# Altium project Power_Board.PrjPcb (part 2 of 3)

## Sheet Power_Reset.SchDoc: =SheetTitle
size A4; SheetTitle: Logic Power & Reset; DrawnBy: Samyar Sadat Akhavi; DocumentNumber: 4; SheetNumber: 4; SheetTotal: 19
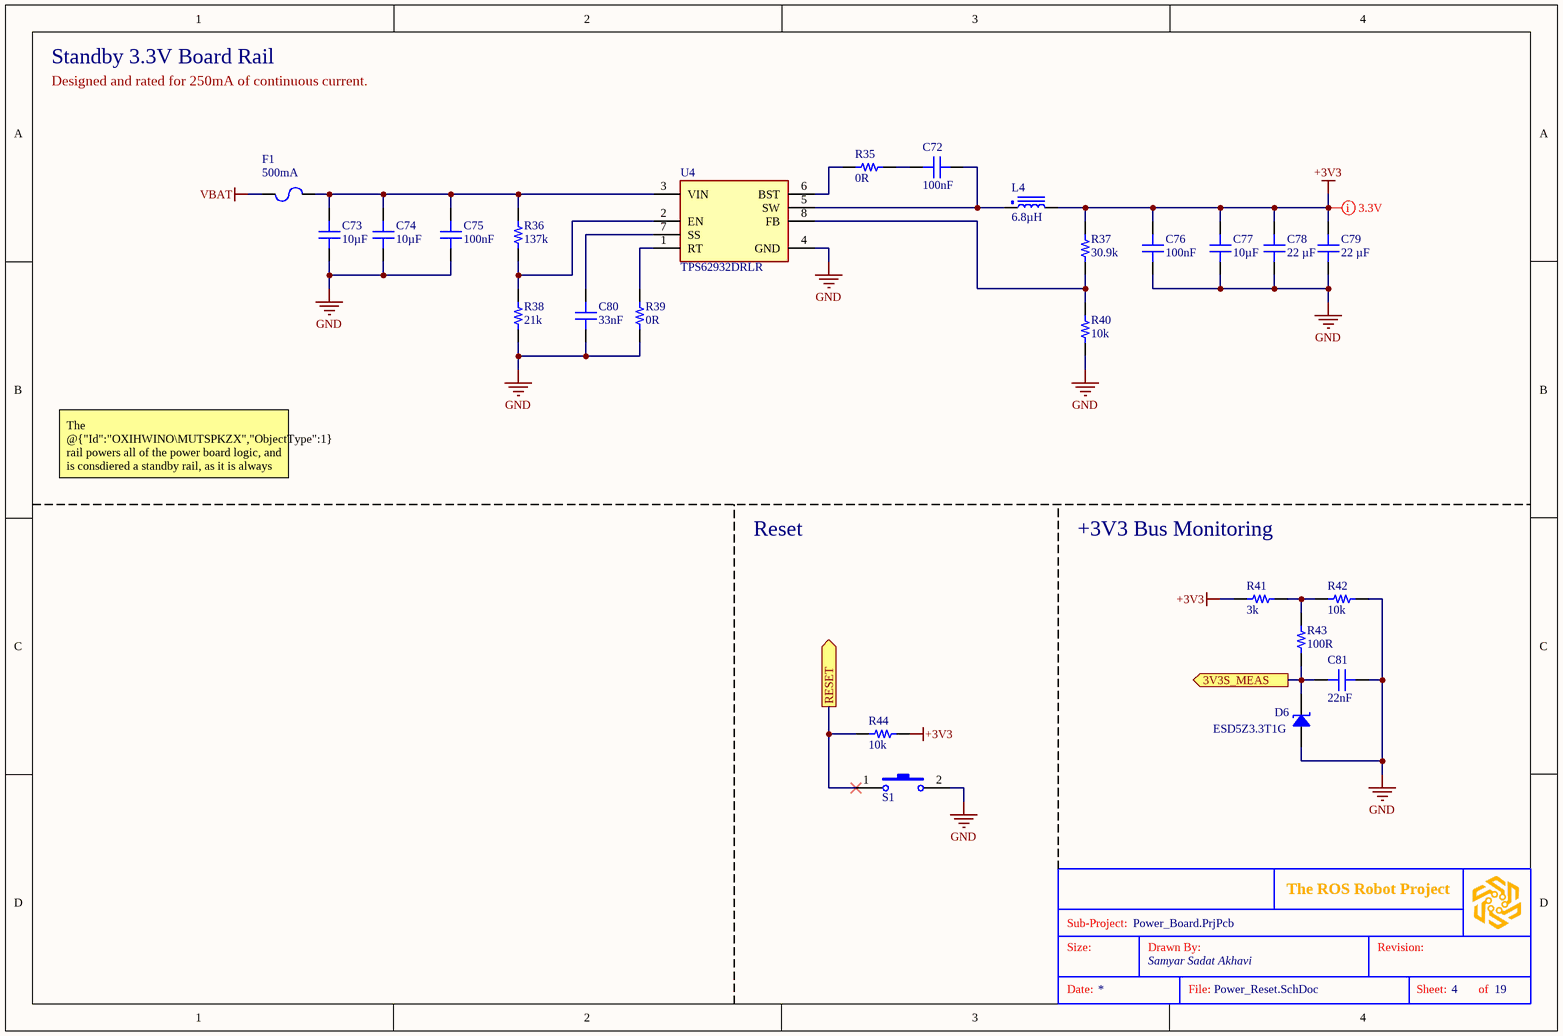
[diagram p7: Power_Reset.SchDoc]

### Parts
(Parts that share a designator on the sheet are numbered #1, #2 ... from top to bottom, then left to right.)
?#6  (no value)  (graphical)
C72  100nF  [CAP 0603_1608]
C73  10µF  [CAP 1206_3216]
C74  10µF  [CAP 1206_3216]
C75  100nF  [CAP 0603_1608]
C76  100nF  [CAP 0603_1608]
C77  10µF  [CAP 1206_3216]
C78  22 µF  [CAP 1206_3216 - 0.8MM]
C79  22 µF  [CAP 1206_3216 - 0.8MM]
C80  33nF  [CAP 0603_1608]
C81  22nF  [CAP 0603_1608]
D6  ESD5Z3.3T1G  [SOD523F]
F1  Current Rating (Amps): 500mA  [FUSE 1206_3216 0.6MM]  (hidden comment: SF-1206F050-2)
L4  6.8µH  [INDPM8682X400N]
R35  0R  [RES 0603_1608]
R36  137k  [RES 0603_1608]
R37  30.9k  [RES 0603_1608]
R38  21k  [RES 0603_1608]
R39  0R  [RES 0603_1608]
R40  10k  [RES 0603_1608]
R41  3k  [RES 0603_1608]
R42  10k  [RES 0603_1608]
R43  100R  [RES 0603_1608]
R44  10k  [RES 0603_1608]
S1  PTS815SJK250SMTRLFS  [PTS815SJK250SMTRLFS]  (value not drawn)
U4  TPS62932DRLR  [SOT8_DRL_TEX]

### Ports
3V3S_MEAS (out, see Power_Board[2A], Microcontroller[3C]), RESET (out, see Power_Board[2A])

### Nets
+3V3: C76.1 C77.2 C78.2 C79.2 L4.2 R37.2 R41.1 R44.1
GND: C73.1 C74.1 C75.2 C76.2 C77.1 C78.1 C79.1 C80.1 C81.2 D6.1 R38.1 R39.1 R40.1 R42.2 S1.2(NO) U4.4(GND)
VBAT: F1.1
3V3S_MEAS: C81.1 D6.2 R43.2 ; port 3V3S_MEAS
RESET: R44.2 S1.1(COM) ; port RESET
NetC72_1: C72.1 R35.1
NetC72_2: C72.2 L4.1 U4.5(SW)
NetC73_2: C73.2 C74.2 C75.1 F1.2 R36.2 U4.3(VIN)
NetC80_2: C80.2 U4.7(SS)
NetR35_2: R35.2 U4.6(BST)
NetR36_1: R36.1 R38.2 U4.2(EN)
NetR37_1: R37.1 R40.2 U4.8(FB)
NetR39_2: R39.2 U4.1(RT)
NetR41_2: R41.2 R42.1 R43.1

### Layout directives
rule Supply Nets [Voltage = 3.300]: +3V3

### Notes on the sheet
- Standby 3.3V Board Rail
- Designed and rated for 250mA of continuous current.
- The @{"Id":"OXIHWINO\MUTSPKZX","ObjectType":1} rail powers all of the power board logic, and is consdiered a standby rail, as it is always on (assuming battery voltage is >9V).
- Reset
- +3V3 Bus Monitoring
- Sub-Project:
- Size:
- Drawn By:
- Revision:
- Date:
- File:
- Sheet:
- of

### Library data of the parts
?#6 = SGR-STDTBSA4: STANDARD SCHEMATICS TITLE BLOCK
C72 C75 C76 = GEN-CC100NT10V50KX7R603: as C23 on sheet Voltage_Reg_12V; Part Number: GEN-CC100NT10V50KX7R603; Value: 100nF
C73 C74 C77 = GEN-CC10UT10V25KX7R1206: GENERIC 1206 MLC CAPACITOR; Tolerance: ±10%; Voltage: 25V; Dielectric: X7R; Part Number: GEN-CC10UT10V25KX7R1206; Value: 10µF
C78 C79 = CL31A226KAHNNNE: as C15 on sheet Voltage_Reg_SBC; Part Number: CL31A226KAHNNNE; Capacitance: 22 µF; Applications: General Purpose; componentlink1description: Datasheet; componentlink1url: http://www.samsungsem.com/kr/support/product-search/mlcc/CL31A226KAHNNNE.jsp; componentlink2description: DigiKey Link; componentlink2url: https://www.digikey.com/en/products/detail/samsung-electro-mechanics/CL31A226KAHNNNE/3888705; Device Package: 1206 (3216 Metric); lastupdated: 4/6/2026 7:37:25 PM; Lifecycle Status: Active; Minimum Order: 1; Mounting Type: Surface Mount, MLCC; Operating Temperature: -55°C ~ 85°C; Package / Case: 1206 (3216 Metric); packaging: TapeAndReel; partid: 22185; Part Status: Active; price: 0.06; series: CL; Size / Dimension: 0.126" L x 0.063" W (3.20mm x 1.60mm); Supplier 1: DigiKey; Supplier Part Number 1: 1276-3047-1-ND; Temperature Coefficient: X5R; Thickness (Max): 0.071" (1.80mm); value: 22 µF; Voltage - Rated: 25V
C80 = GEN-CC33NT5V25KX7R603: GENERIC 0603 MLC CAPACITOR; Tolerance: ±5%; Voltage: 25V; Dielectric: X7R; Part Number: GEN-CC33NT5V25KX7R603; Value: 33nF
C81 = GEN-CC22NT20V25KX7R603: GENERIC 0603 MLC CAPACITOR; Tolerance: ±20%; Voltage: 25V; Dielectric: X7R; Part Number: GEN-CC22NT20V25KX7R603; Value: 22nF
D6 = ESD5Z3.3T1G: TVS DIODE 3.3V 14.1V SOD523; Manufacturer: ON Semiconductor; Capacitance @ Frequency: 105pF @ 1MHz; Current - Peak Pulse (10/1000µs): 11.2A (8/20µs); Power Line Protection: No; Power - Peak Pulse: 158W; Type: Zener; Unidirectional Channels: 1; Voltage - Breakdown (Min): 5V; Voltage - Reverse Standoff (Typ): 3.3V (Max); Part Number: ESD5Z3.3T1G; Applications: General Purpose; ComponentLink1Description: Datasheet; ComponentLink1URL: https://www.onsemi.com/pub/Collateral/ESD5Z2.5T1-D.PDF; ComponentLink2Description: DigiKey Link; ComponentLink2URL: http://digikey.com/product-detail/en/on-semiconductor/ESD5Z3.3T1G/ESD5Z3.3T1GOSCT-ND/1967044; LastUpdated: 4/5/2026 9:01:13 PM; Lifecycle Status: Active; Minimum Order: 1; Mounting Type: Surface Mount; Operating Temperature: -55°C ~ 150°C (TJ); Package / Case: SC-79, SOD-523; Packaging: TapeAndReel; PartId: 9754; Part Status: Active; Price: 0.04; Series: -; Supplier 1: DigiKey; Supplier Part Number 1: ESD5Z3.3T1GOSCT-ND; Supplier Device Package: SOD-523; Voltage - Clamping (Max) @ Ipp: 14.1V
F1 = SF-1206F050-2: FUSE BOARD MNT 500MA 63VDC 1206; Manufacturer: Bourns Inc.; Approval Agency: UL; Breaking Capacity @ Rated Voltage: 50A; Fuse Type: Board Mount (Cartridge Style Excluded); Melting I²t: 0.011; Response Time: Fast Blow; Voltage Rating - DC: 63V; Part Number: SF-1206F050-2; Approvals: UL; ComponentLink1Description: Datasheet; ComponentLink1URL: https://www.bourns.com/pdfs/SF1206F.pdf; ComponentLink2Description: DigiKey Link; ComponentLink2URL: http://digikey.com/product-detail/en/bourns-inc/SF-1206F050-2/SF-1206F050-2CT-ND/1948200; Device Package: 1206 (3216 Metric); LastUpdated: 9/2/2020 1:30:42 AM; Lifecycle Status: Active; Minimum Order: 1; Mounting Type: Surface Mount; Operating Temperature: -40°C ~ 105°C; Package / Case: 1206 (3216 Metric); Packaging: TapeAndReel; Part Status: Active; Price: 0.31; Series: SinglFuse™ SF-1206F; Size / Dimension: 0.122" L x 0.061" W x 0.024" H (3.10mm x 1.55mm x 0.60mm); Supplier 1: DigiKey; Supplier Part Number 1: SF-1206F050-2CT-ND
L4 = IHLP3232DZER6R8M11: FIXED IND 6.8UH 7A 33.4 MOHM SMD; Manufacturer: Vishay Dale; Tolerance: ±20%; Saturation Current: 6.7A; Part Number: IHLP3232DZER6R8M11; Value: 6.8µH; Current Rating: 7A; DC Resistance: 33.4mOhm; Supplier 1: DigiKey; Supplier Part Number 1: 541-1355-1-ND
R35 R39 = GEN-CRR0603: GENERIC 0603 CHIP RESISTOR (JUMPER); Part Number: GEN-CRR0603; Value: 0R
R36 = GEN-CRR137KT1P8603: GENERIC 0603 CHIP RESISTOR; Tolerance: ±1%; Power: 0.125W; Part Number: GEN-CRR137KT1P8603; Value: 137k
R37 = GEN-CRR30K9T1P8603: GENERIC 0603 CHIP RESISTOR; Tolerance: ±1%; Power: 0.125W; Part Number: GEN-CRR30K9T1P8603; Value: 30.9k
R38 = GEN-CRR21KT1P8603: GENERIC 0603 CHIP RESISTOR; Tolerance: ±1%; Power: 0.125W; Part Number: GEN-CRR21KT1P8603; Value: 21k
R40 R42 R44 = GEN-CRR10KT1P8603: as R18 on sheet Voltage_Reg_12V; Part Number: GEN-CRR10KT1P8603; Value: 10k
R41 = GEN-CRR3KT1P8603: GENERIC 0603 CHIP RESISTOR; Tolerance: ±1%; Power: 0.125W; Part Number: GEN-CRR3KT1P8603; Value: 3k
R43 = GEN-CRR100T1P8603: as R77 on sheet STD_Protect; Part Number: GEN-CRR100T1P8603; Value: 100R
S1 = PTS815SJK250SMTRLFS: SWITCH TACTILE SPST-NO 0.05A 12V; Manufacturer: C&K; Part Number: PTS815SJK250SMTRLFS; Circuit: SPST-NO; Supplier 1: DigiKey; Supplier Part Number 1: CKN12216-1-ND
U4 = TPS62932DRLR: IC REG BUCK ADJ 2A SOT583; Manufacturer: Texas Instruments; Copyright: Copyright (C) 2025 Ultra Librarian. All rights reserved.; Part Number: TPS62932DRLR; Supplier 1: DigiKey; Supplier Part Number 1: 296-TPS62932DRLRCT-ND

## Sheet Microcontroller.SchDoc: =SheetTitle
size B; SheetTitle: Microcontroller; DrawnBy: Samyar Sadat Akhavi; DocumentNumber: 5; SheetNumber: 5; SheetTotal: 19
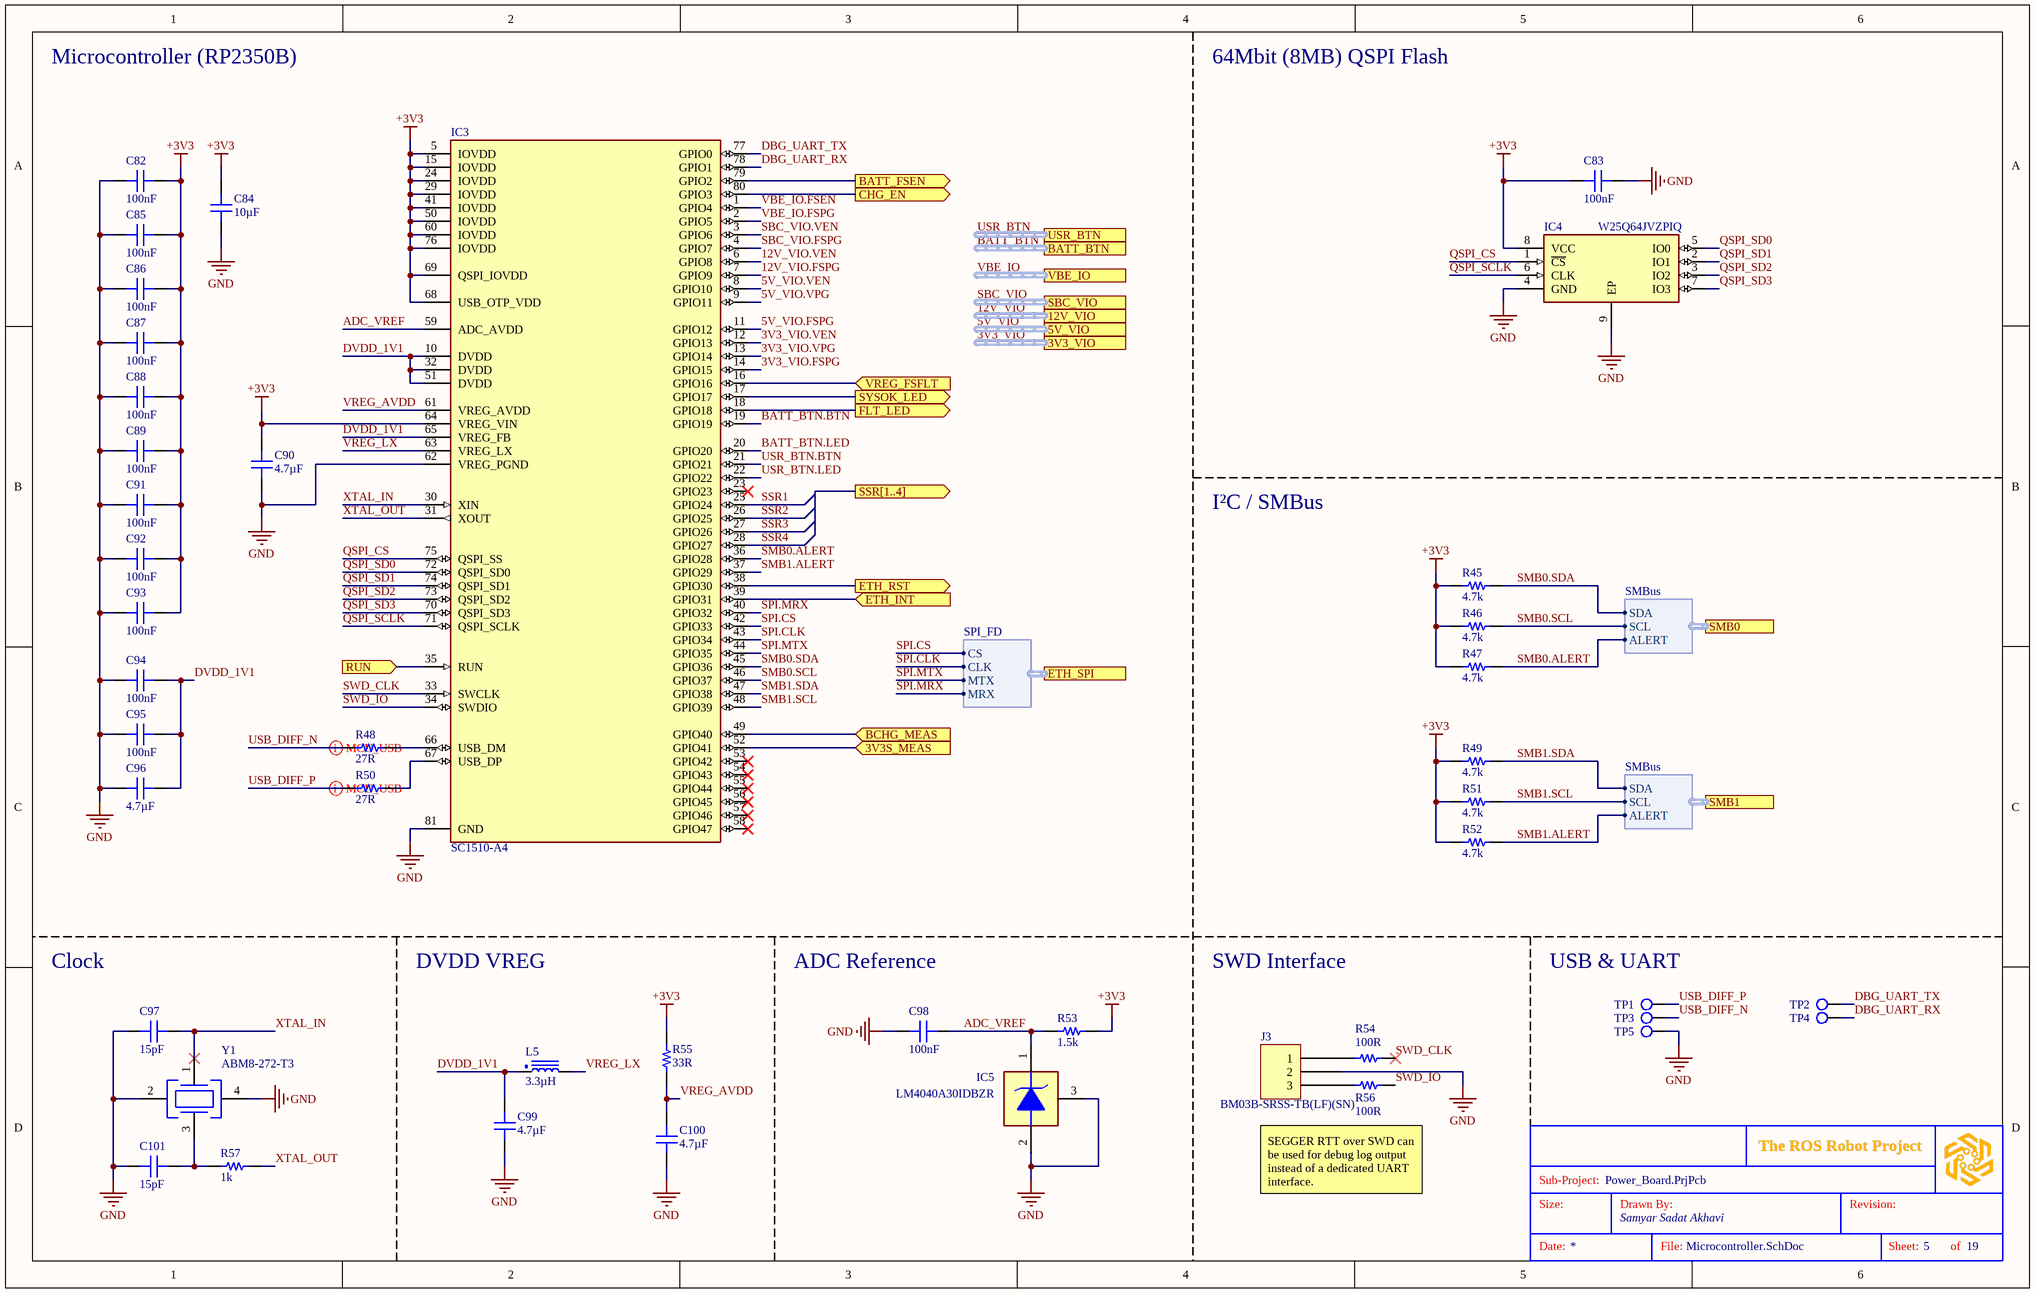
[diagram p8: Microcontroller.SchDoc]

### Parts
(Parts that share a designator on the sheet are numbered #1, #2 ... from top to bottom, then left to right.)
?#7  (no value)  (graphical)
C82  100nF  [CAP 0402_1005]
C83  100nF  [CAP 0603_1608]
C84  10µF  [CAP 1206_3216]
C85  100nF  [CAP 0402_1005]
C86  100nF  [CAP 0402_1005]
C87  100nF  [CAP 0402_1005]
C88  100nF  [CAP 0402_1005]
C89  100nF  [CAP 0402_1005]
C90  4.7µF  [CAP 0402_1005]
C91  100nF  [CAP 0402_1005]
C92  100nF  [CAP 0402_1005]
C93  100nF  [CAP 0402_1005]
C94  100nF  [CAP 0402_1005]
C95  100nF  [CAP 0402_1005]
C96  4.7µF  [CAP 0402_1005]
C97  15pF  [CAP 0402_1005]
C98  100nF  [CAP 0603_1608]
C99  4.7µF  [CAP 0402_1005]
C100  4.7µF  [CAP 0402_1005]
C101  15pF  [CAP 0402_1005]
IC3  SC1510-A4  [QFN40P1000X1000X90-81N-D]
IC4  W25Q64JVZPIQ  [SON127P600X500X80-9N-D]
IC5  LM4040A30IDBZR  [SOT95P237X112-3N]
J3  BM03B-SRSS-TB(LF)(SN)  [JST BM03B-SRSS-TB]
L5  3.3µH  [AOTAB201610S3R3101T]
R45  4.7k  [RES 0603_1608]
R46  4.7k  [RES 0603_1608]
R47  4.7k  [RES 0603_1608]
R48  27R  [RES 0603_1608]
R49  4.7k  [RES 0603_1608]
R50  27R  [RES 0603_1608]
R51  4.7k  [RES 0603_1608]
R52  4.7k  [RES 0603_1608]
R53  1.5k  [RES 0603_1608]
R54  100R  [RES 0603_1608]
R55  33R  [RES 0402_1005]
R56  100R  [RES 0603_1608]
R57  1k  [RES 0402_1005]
TP1  Test Point  [Test_Point_2mm]  (value not drawn)  (no BOM)
TP2  Test Point  [Test_Point_2mm]  (value not drawn)  (no BOM)
TP3  Test Point  [Test_Point_2mm]  (value not drawn)  (no BOM)
TP4  Test Point  [Test_Point_2mm]  (value not drawn)  (no BOM)
TP5  Test Point  [Test_Point_2mm]  (value not drawn)  (no BOM)
Y1  ABM8-272-T3  [ABM8272T3]

### Ports
3V3_VIO (harness V3I_VIO, see Power_Board[3B], Voltage_Regulators[5D]), 3V3S_MEAS (in, see Power_Board[2A], Power_Reset[4C]), 5V_VIO (harness V3I_VIO, see Power_Board[3B], Voltage_Regulators[5C]), 12V_VIO (harness VHP_VIO, see Power_Board[3B], Voltage_Regulators[5B]), BATT_BTN (harness USR_BTN, see Power_Board[2B], User_Control_IO[4A]), BATT_FSEN (out, see Power_Board[2B]), BCHG_MEAS (in, see Power_Board[2B], Charger_Input[2B]), CHG_EN (out, see Power_Board[2B], Charger_Input[1B]), ETH_INT (in, see Power_Board[3B]), ETH_RST (out, see Power_Board[3B]), ETH_SPI (harness SPI_FD, see Power_Board[3B]), FLT_LED (out, see Power_Board[3C]), RUN (in, see Power_Board[2A]), SBC_VIO (harness VHP_VIO, see Power_Board[3B], Voltage_Regulators[5A]), SMB0 (harness SMBus, see Power_Board[2C]), SMB1 (harness SMBus, see Power_Board[2C]), SSR[1..4] (out, see Power_Board[3B], External_SSR[2A]), SYSOK_LED (out, see Power_Board[3C]), USR_BTN (harness USR_BTN, see Power_Board[2B], User_Control_IO[4C]), VBE_IO (harness VBP_IO, see Power_Board[3A], VBAT_Output[1B]), VREG_FSFLT (in, see Power_Board[3B])

### Harnesses
SMBus: SDA, SCL, ALERT
SPI_FD: MRX, MTX, CLK, CS

### Nets
+3V3: C82.2 C83.1 C84.2 C85.2 C86.2 C87.2 C88.2 C89.2 C90.2 C91.2 C92.2 C93.2 IC3.5(IOVDD) IC3.15(IOVDD) IC3.24(IOVDD) IC3.29(IOVDD) IC3.41(IOVDD) IC3.50(IOVDD) IC3.60(IOVDD) IC3.64(VREG_VIN) IC3.68(USB_OTP_VDD) IC3.69(QSPI_IOVDD) IC3.76(IOVDD) IC4.8(VCC) R45.1 R46.1 R47.1 R49.1 R51.1 R52.1 R53.2 R55.2
GND: C82.1 C83.2 C84.1 C85.1 C86.1 C87.1 C88.1 C89.1 C90.1 C91.1 C92.1 C93.1 C94.1 C95.1 C96.1 C97.1 C98.1 C99.1 C100.1 C101.1 IC3.62(VREG_PGND) IC3.81(GND) IC4.4(GND) IC4.9(EP) IC5.2(A) IC5.3 J3.2 TP5.1 Y1.2(GND_1) Y1.4(GND_2)
3V3_VIO.FSPG: IC3.14(GPIO15)
3V3_VIO.VEN: IC3.12(GPIO13)
3V3_VIO.VPG: IC3.13(GPIO14)
3V3S_MEAS: IC3.52(GPIO41) ; port 3V3S_MEAS
5V_VIO.FSPG: IC3.11(GPIO12)
5V_VIO.VEN: IC3.8(GPIO10)
5V_VIO.VPG: IC3.9(GPIO11)
12V_VIO.FSPG: IC3.7(GPIO9)
12V_VIO.VEN: IC3.6(GPIO8)
ADC_VREF: C98.2 IC3.59(ADC_AVDD) IC5.1(K) R53.1
BATT_BTN.BTN: IC3.19(GPIO19)
BATT_BTN.LED: IC3.20(GPIO20)
BCHG_MEAS: IC3.49(GPIO40) ; port BCHG_MEAS
BEFS_EN: IC3.79(GPIO2) ; port BATT_FSEN
CHG_EN: IC3.80(GPIO3) ; port CHG_EN
DBG_UART_RX: IC3.78(GPIO1) TP4.1
DBG_UART_TX: IC3.77(GPIO0) TP2.1
DVDD_1V1: C94.2 C95.2 C96.2 C99.2 IC3.10(DVDD) IC3.32(DVDD) IC3.51(DVDD) IC3.65(VREG_FB) L5.1
ETH_INT: IC3.39(GPIO31) ; port ETH_INT
ETH_RST: IC3.38(GPIO30) ; port ETH_RST
FLT_LED: IC3.18(GPIO18) ; port FLT_LED
FS_GFLT: IC3.16(GPIO16) ; port VREG_FSFLT
QSPI_CS: IC3.75(QSPI_SS) IC4.1(~{CS})
QSPI_SCLK: IC3.71(QSPI_SCLK) IC4.6(CLK)
QSPI_SD0: IC3.72(QSPI_SD0) IC4.5(IO0)
QSPI_SD1: IC3.74(QSPI_SD1) IC4.2(IO1)
QSPI_SD2: IC3.73(QSPI_SD2) IC4.3(IO2)
QSPI_SD3: IC3.70(QSPI_SD3) IC4.7(IO3)
RESET: IC3.35(RUN) ; port RUN
SBC_VIO.FSPG: IC3.4(GPIO7)
SBC_VIO.VEN: IC3.3(GPIO6)
SMB0.ALERT: IC3.36(GPIO28) R47.2 ; port SMB0.ALERT  [project net SMB.ALERT]
SMB0.SCL: IC3.46(GPIO37) R46.2 ; port SMB0.SCL  [project net SMB.SCL]
SMB0.SDA: IC3.45(GPIO36) R45.2 ; port SMB0.SDA  [project net SMB.SDA]
SMB1.ALERT: IC3.37(GPIO29) R52.2 ; port SMB1.ALERT  [project net SMB.ALERT]
SMB1.SCL: IC3.48(GPIO39) R51.2 ; port SMB1.SCL  [project net SMB.SCL]
SMB1.SDA: IC3.47(GPIO38) R49.2 ; port SMB1.SDA  [project net SMB.SDA]
SPI.CLK: IC3.43(GPIO34) ; port ETH_SPI.CLK
SPI.CS: IC3.42(GPIO33) ; port ETH_SPI.CS
SPI.MRX: IC3.40(GPIO32) ; port ETH_SPI.MRX
SPI.MTX: IC3.44(GPIO35) ; port ETH_SPI.MTX
SSR1: IC3.25(GPIO24)
SSR2: IC3.26(GPIO25)
SSR3: IC3.27(GPIO26)
SSR4: IC3.28(GPIO27)
SWD_CLK: IC3.33(SWCLK) R54.1
SWD_IO: IC3.34(SWDIO) R56.1
SYSOK_LED: IC3.17(GPIO17) ; port SYSOK_LED
USB_DIFF_N: R48.1 TP3.1
USB_DIFF_P: R50.1 TP1.1
USR_BTN.BTN: IC3.21(GPIO21)
USR_BTN.LED: IC3.22(GPIO22)
VBE_IO.FSEN: IC3.1(GPIO4)
VBE_IO.FSPG: IC3.2(GPIO5)
VREG_AVDD: C100.2 IC3.61(VREG_AVDD) R55.1
VREG_LX: IC3.63(VREG_LX) L5.2
XTAL_IN: C97.2 IC3.30(XIN) Y1.1(CRYSTAL_1)
XTAL_OUT: IC3.31(XOUT) R57.2
NetC101_2: C101.2 R57.1 Y1.3(CRYSTAL_2)
NetIC3_66: IC3.66(USB_DM) R48.2
NetIC3_67: IC3.67(USB_DP) R50.2
NetJ3_1: J3.1 R54.2
NetJ3_3: J3.3 R56.2

Not connected (* = marked no-connect by the designer): IC3 23(GPIO23)* 53(GPIO42)* 54(GPIO43)* 55(GPIO44)* 56(GPIO45)* 57(GPIO46)* 58(GPIO47)*

### Buses and harness runs
harness 3V3_VIO = port 3V3_VIO
harness 5V_VIO = port 5V_VIO
harness 12V_VIO = port 12V_VIO
harness BATT_BTN = port BATT_BTN
harness SBC_VIO = port SBC_VIO
harness USR_BTN = port USR_BTN
harness VBE_IO = port VBE_IO

### Layout directives
differential pair: USB_DIFF_N, USB_DIFF_P

### Notes on the sheet
- Microcontroller (RP2350B)
- 64Mbit (8MB) QSPI Flash
- I²C / SMBus
- Clock
- DVDD VREG
- ADC Reference
- SWD Interface
- USB & UART
- SEGGER RTT over SWD can be used for debug log output instead of a dedicated UART interface.
- Sub-Project:
- Size:
- Drawn By:
- Revision:
- Date:
- File:
- Sheet:
- of

### Library data of the parts
?#7 = SGR-STDTBSB: STANDARD SCHEMATICS TITLE BLOCK
C82 C85-C89 C91-C95 = GEN-CC100NT106V3KX7R402: GENERIC 0402 MLC CAPACITOR; Tolerance: ±10%; Voltage: 6.3V; Dielectric: X7R; Part Number: GEN-CC100NT106V3KX7R402; Value: 100nF
C83 C98 = GEN-CC100NT10V50KX7R603: as C23 on sheet Voltage_Reg_12V; Part Number: GEN-CC100NT10V50KX7R603; Value: 100nF
C84 = GEN-CC10UT10V25KX7R1206: as C73 on sheet Power_Reset; Part Number: GEN-CC10UT10V25KX7R1206; Value: 10µF
C90 C96 C99 C100 = GEN-CC4U7T106V3KX5R402: GENERIC 0402 MLC CAPACITOR; Tolerance: ±10%; Voltage: 6.3V; Dielectric: X5R; Part Number: GEN-CC4U7T106V3KX5R402; Value: 4.7µF
C97 C101 = GEN-CC15PT1V25KC0G402: GENERIC 0402 MLC CAPACITOR; Tolerance: ±1%; Voltage: 25V; Dielectric: C0G; Part Number: GEN-CC15PT1V25KC0G402; Value: 15pF
IC3 = SC1510-A4: RASPBERRY PI RP2350B A4 MICROCONTROLLER; Part Number: SC1510-A4; Manufacturer: Raspberry Pi; Supplier 1: DigiKey; Supplier Part Number 1: 2648-SC1510-A4CT-ND
IC4 = W25Q64JVZPIQ: IC FLASH 64MBIT SPI/QUAD 8WSON; Manufacturer: Winbond Electronics; Part Number: W25Q64JVZPIQ; Supplier 1: DigiKey; Supplier Part Number 1: 256-W25Q64JVZPIQ-TRAY-ND
IC5 = LM4040A30IDBZR: IC VREF SHUNT 0.1% SOT23-3; Manufacturer: Texas Instruments; Part Number: LM4040A30IDBZR; Supplier 1: DigiKey; Supplier Part Number 1: 296-20861-1-ND
J3 = BM03B-SRSS-TB(LF)(SN): CONN HEADER SMD 3POS 1MM; Manufacturer: JST Sales America Inc.; Current Rating (Amps): 0.7A; Material Flammability Rating: UL94 V-0; Number of Positions: 3; Number of Positions Loaded: All; Pitch - Mating: 0.039" (1.00mm); Shrouding: Shrouded - 4 Wall; Style: Board to Cable/Wire; Voltage Rating: 50V; Part Number: BM03B-SRSS-TB(LF)(SN); ComponentLink1Description: Datasheet; ComponentLink1URL: http://www.jst-mfg.com/product/pdf/eng/eSR.pdf; ComponentLink2Description: DigiKey Link; ComponentLink2URL: http://digikey.com/product-detail/en/jst-sales-america-inc/BM03B-SRSS-TB-LF-SN/455-1789-1-ND/926860; Connector Type: Header; Contact Finish - Mating: Tin; Contact Finish - Post: Tin; Contact Material: Copper Alloy; Contact Shape: Square; Contact Type: Male Pin; Fastening Type: Push-Pull; Features: Solder Retention; Insulation Color: Natural; Insulation Height: 0.167" (4.25mm); Insulation Material: Polyamide (PA), Nylon; LastUpdated: 1/12/2020 10:12:14 PM; Lifecycle Status: Active; Minimum Order: 1; Mounting Type: Surface Mount; Number of Rows: 1; Operating Temperature: -25°C ~ 85°C; Packaging: TapeAndReel; PartId: 14; Part Status: Active; Price: 0.24; Series: SR; Supplier 1: DigiKey; Supplier Part Number 1: 455-1789-1-ND; Termination: Solder
L5 = AOTA-B201610S3R3-101-T: FIXED IND 3.3UH 2.1A 140 MOHM; Manufacturer: Abracon LLC; Tolerance: ±20%; Saturation Current: 2.4A; Part Number: AOTA-B201610S3R3-101-T; Value: 3.3µH; Current Rating: 2.1A; DC Resistance: 140mOhm; Supplier 1: DigiKey; Supplier Part Number 1: 535-AOTA-B201610S3R3-101-TCT-ND
R45-R47 R49 R51 R52 = GEN-CRR4K7T5P8603: GENERIC 0603 CHIP RESISTOR; Tolerance: ±5%; Power: 0.125W; Part Number: GEN-CRR4K7T5P8603; Value: 4.7k
R48 R50 = GEN-CRR27T1P8603: GENERIC 0603 CHIP RESISTOR; Tolerance: ±1%; Power: 0.125W; Part Number: GEN-CRR27T1P8603; Value: 27R
R53 = GEN-CRR1K5T1P8603: GENERIC 0603 CHIP RESISTOR; Tolerance: ±1%; Power: 0.125W; Part Number: GEN-CRR1K5T1P8603; Value: 1.5k
R54 R56 = GEN-CRR100T1P8603: as R77 on sheet STD_Protect; Part Number: GEN-CRR100T1P8603; Value: 100R
R55 = GEN-CRR33T5P16402: GENERIC 0402 CHIP RESISTOR; Tolerance: ±5%; Power: 0.0625W; Part Number: GEN-CRR33T5P16402; Value: 33R
R57 = GEN-CRR1KT1P16402: GENERIC 0402 CHIP RESISTOR; Tolerance: ±1%; Power: 0.0625W; Part Number: GEN-CRR1KT1P16402; Value: 1k
TP1-TP5 = GEN-PCBTPS2: CIRCULAR PCB TEST POINT PAD; Part Number: GEN-PCBTPS2; Size Variant: 2mm
Y1 = ABM8-272-T3: CRYSTAL 12.0000MHZ 10PF SMD; Manufacturer: Abracon LLC; Frequency: 12MHz; Stability: ±30ppm; ESR: 50Ohms; Part Number: ABM8-272-T3; Tolerance: ±30ppm; Load Capacitance: 10pF; Supplier 1: DigiKey; Supplier Part Number 1: 535-ABM8-272-T3CT-ND

## Sheet Battery_Input.SchDoc: =SheetTitle
size B; SheetTitle: Battery Input; DrawnBy: Samyar Sadat Akhavi; DocumentNumber: 2; SheetNumber: 2; SheetTotal: 19
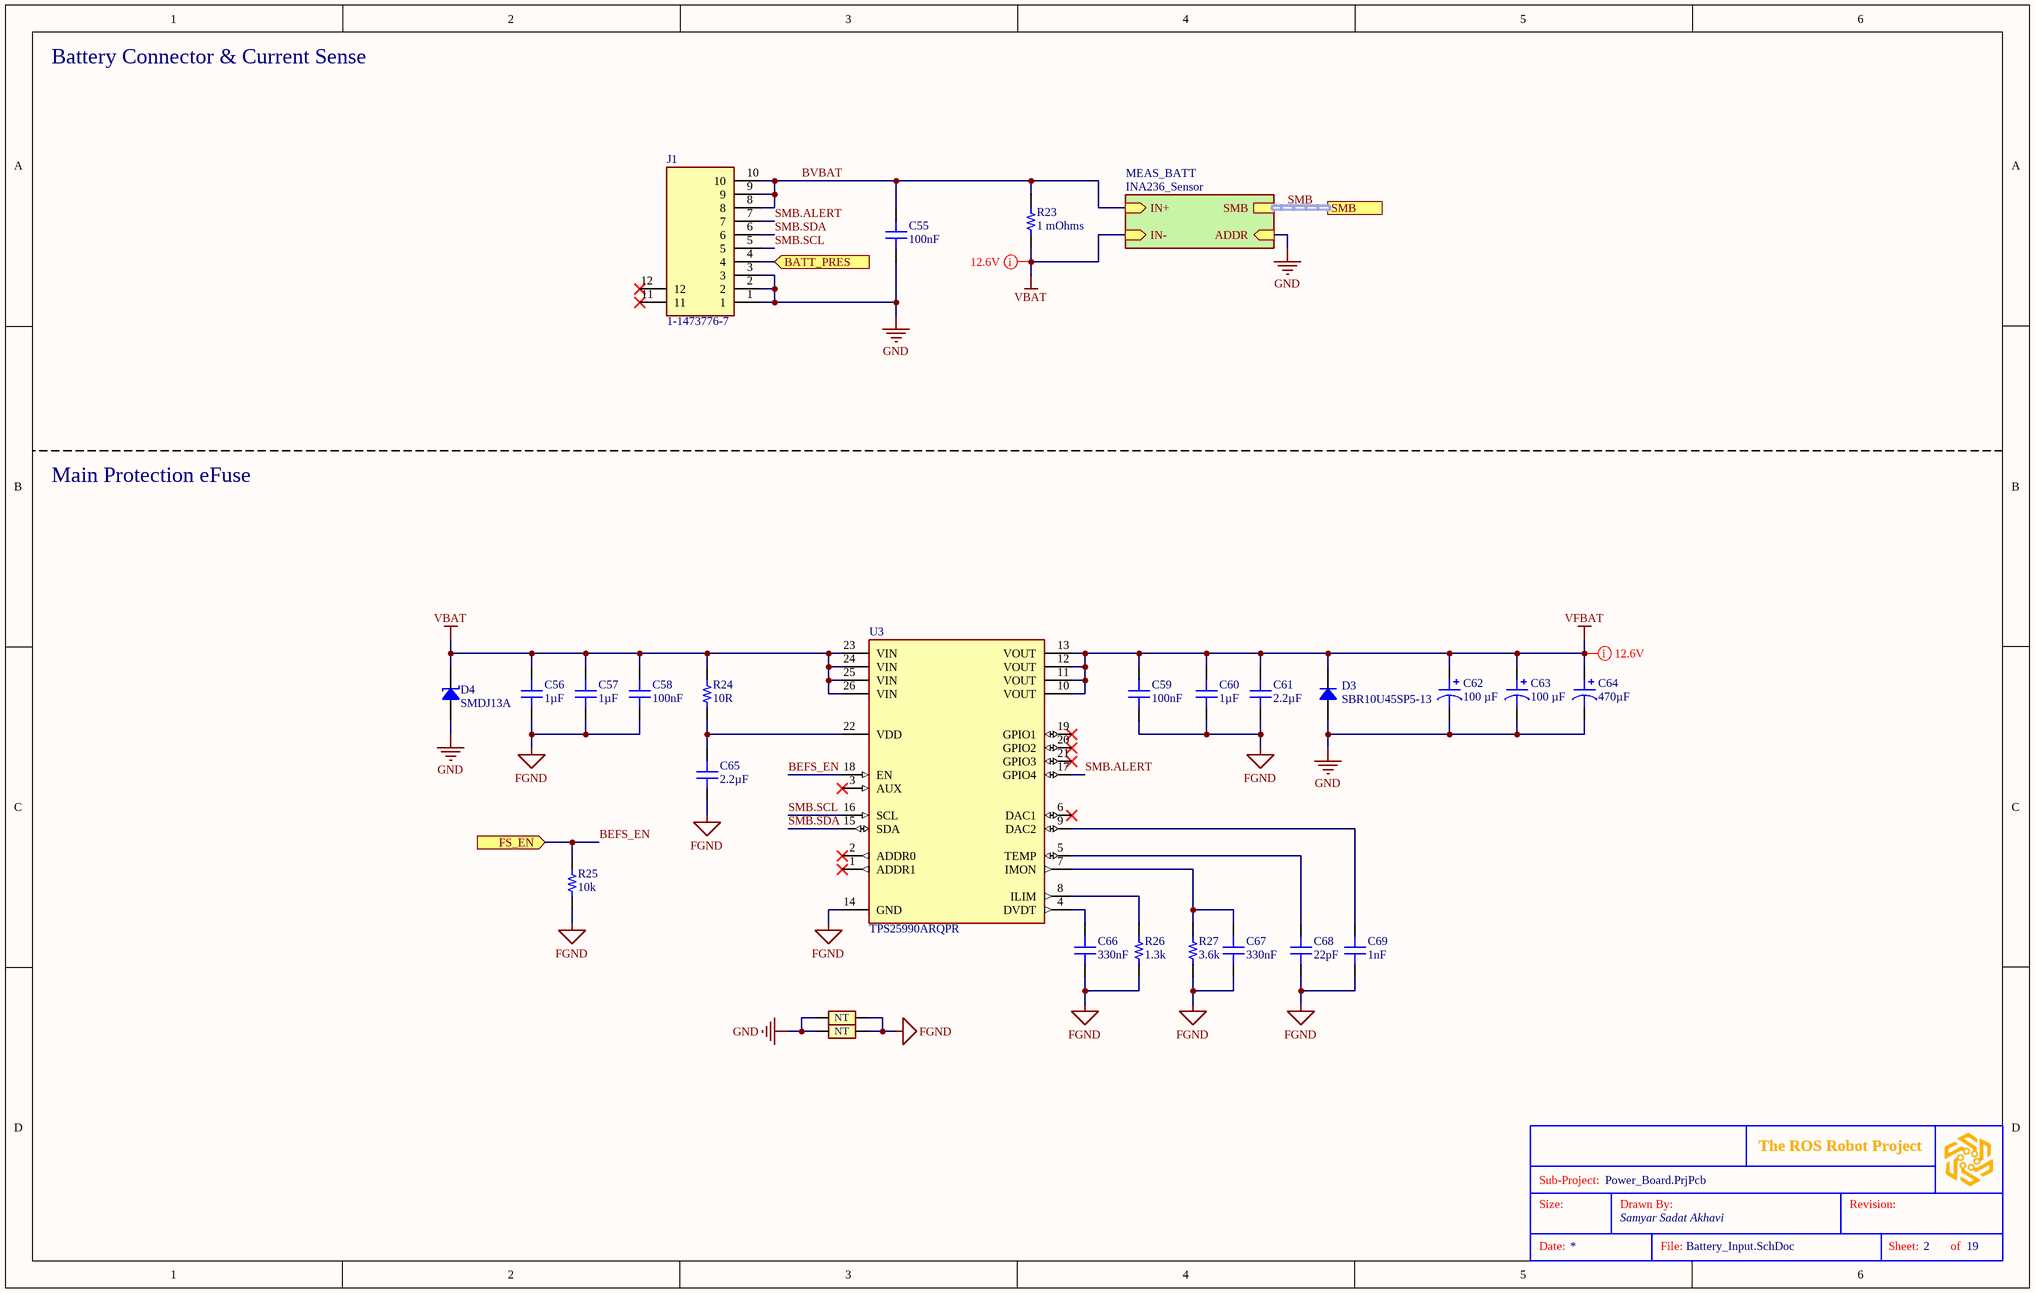
[diagram p9: Battery_Input.SchDoc]

### Parts
(Parts that share a designator on the sheet are numbered #1, #2 ... from top to bottom, then left to right.)
?#8  (no value)  (graphical)
C55  100nF  [CAP 0603_1608]
C56  1µF  [CAP 0603_1608]
C57  1µF  [CAP 0603_1608]
C58  100nF  [CAP 0603_1608]
C59  100nF  [CAP 0603_1608]
C60  1µF  [CAP 0603_1608]
C61  2.2µF  [CAP 0805_2012]
C62  100 µF  [CAP ALSMD 6.6MM H7.7MM]
C63  100 µF  [CAP ALSMD 6.6MM H7.7MM]
C64  470µF  [CAP_A781-MN_KEM]
C65  2.2µF  [CAP 0805_2012]
C66  330nF  [CAP 0603_1608]
C67  330nF  [CAP 0603_1608]
C68  22pF  [CAP 0603_1608]
C69  1nF  [CAP 0603_1608]
D3  SBR10U45SP5-13  [DIODES INC SDT10A45P5]
D4  SMDJ13A  [DO214AB SMC]
J1  1-1473776-7  [114737767]
NT6  Net Tie  [Net_Tie_Via]  (value not drawn)  (net tie, no BOM)
NT7  Net Tie  [Net_Tie_Via]  (value not drawn)  (net tie, no BOM)
R23  1 mOhms  [RES 2512_6432]
R24  10R  [RES 0603_1608]
R25  10k  [RES 0603_1608]
R26  1.3k  [RES 0603_1608]
R27  3.6k  [RES 0603_1608]
U3  TPS25990ARQPR  [VQFN26_RQP_TEX]

### Sub-sheets
MEAS_BATT = INA236_Sensor (file not in this document): IN- (in), ADDR (in), SMB (harness SMBus), IN+ (in)

### Ports
BATT_PRES (in, see Power_Board[1B], User_Control_IO[2B]), FS_EN (in, see Power_Board[2B]), SMB (harness SMBus, see Power_Board[1B], Charger_Input[1C], INA236_Sensor[3B], TMP112_Sensor[3B], VBAT_Output[3B])

### Nets
FGND: C56.1 C57.1 C58.2 C59.2 C60.1 C61.1 C65.1 C66.1 C67.1 C68.1 C69.1 NT6.2 NT7.2 R25.2 R26.1 R27.1 U3.14(GND)
GND: C55.2 C62.2 C63.2 C64.2 D3.2 D4.1 J1.1 J1.2 J1.3 NT6.1 NT7.1 ; sheet MEAS_BATT/ADDR
VBAT: C56.2 C57.2 C58.1 D4.2 R23.1 R24.2 U3.23(VIN) U3.24(VIN) U3.25(VIN) U3.26(VIN) ; sheet MEAS_BATT/IN-
VFBAT: C59.1 C60.2 C61.2 C62.1 C63.1 C64.1 D3.1 U3.10(VOUT) U3.11(VOUT) U3.12(VOUT) U3.13(VOUT)
BATT_PRES: J1.4 ; port BATT_PRES
BEFS_EN: R25.1 U3.18(EN) ; port FS_EN
BVBAT: C55.1 J1.8 J1.9 J1.10 R23.2 ; sheet MEAS_BATT/IN+
SMB.ALERT: J1.7 U3.17(GPIO4)
SMB.SCL: J1.5 U3.16(SCL)
SMB.SDA: J1.6 U3.15(SDA)
NetC65_2: C65.2 R24.1 U3.22(VDD)
NetC66_2: C66.2 U3.4(DVDT)
NetC67_2: C67.2 R27.2 U3.7(IMON)
NetC68_2: C68.2 U3.5(TEMP)
NetC69_2: C69.2 U3.9(DAC2)
NetR26_2: R26.2 U3.8(ILIM)

Not connected (* = marked no-connect by the designer): J1 11* 12*; U3 1(ADDR1)* 2(ADDR0)* 3(AUX)* 6(DAC1)* 19(GPIO1)* 20(GPIO2)* 21(GPIO3)*

### Buses and harness runs
harness SMB = port SMB = sheet MEAS_BATT/SMB

### Layout directives
rule Supply Nets [Voltage = 12.60]: VBAT, VFBAT

### Notes on the sheet
- Battery Connector & Current Sense
- Main Protection eFuse
- Sub-Project:
- Size:
- Drawn By:
- Revision:
- Date:
- File:
- Sheet:
- of
- (in symbol GEN-PCBVINT0S3) NT

### Library data of the parts
?#8 = SGR-STDTBSB: STANDARD SCHEMATICS TITLE BLOCK
C55 C58 C59 = GEN-CC100NT10V50KX7R603: as C23 on sheet Voltage_Reg_12V; Part Number: GEN-CC100NT10V50KX7R603; Value: 100nF
C56 C57 C60 = GEN-CC1UT10V25KX7R603: GENERIC 0603 MLC CAPACITOR; Tolerance: ±10%; Voltage: 25V; Dielectric: X7R; Part Number: GEN-CC1UT10V25KX7R603; Value: 1µF
C61 C65 = GEN-CC2U2T10V25KX7R805: GENERIC 0805 MLC CAPACITOR; Tolerance: ±10%; Voltage: 25V; Dielectric: X7R; Part Number: GEN-CC2U2T10V25KX7R805; Value: 2.2µF
C62 C63 = 865080445010: CAP ALUM 100UF 20% 25V SMD; manufacturer: Würth Elektronik; Impedance: 380 mOhms; Lifetime @ Temp.: 2000 Hrs @ 105°C; Polarization: Polar; Ripple Current @ High Frequency: 290 mA @ 100 kHz; Ripple Current @ Low Frequency: 188.5 mA @ 120 Hz; Surface Mount Land Size: 0.260" L x 0.260" W (6.60mm x 6.60mm); Part Number: 865080445010; Applications: General Purpose; Capacitance: 100 µF; componentlink1description: Datasheet; componentlink1url: https://katalog.we-online.de/pbs/datasheet/865080445010.pdf; componentlink2description: DigiKey Link; componentlink2url: https://www.digikey.com/en/products/detail/würth-elektronik/865080445010/5728033; Device Package: Radial, Can - SMD; Height - Seated (Max): 0.303" (7.70mm); lastupdated: 4/5/2026 8:54:41 PM; Lifecycle Status: Active; Minimum Order: 1; Mounting Type: Surface Mount; Operating Temperature: -55°C ~ 105°C; Package / Case: Radial, Can - SMD; packaging: TapeAndReel; partid: 8228; Part Status: Active; price: 0.16; series: WCAP-ASLI; Size / Dimension: 0.248" Dia (6.30mm); Supplier 1: DigiKey; Supplier Part Number 1: 732-8438-1-ND; Tolerance: ±20%; value: 100 µF; Voltage - Rated: 25 V
C64 = A781MN477M1ELAS025: CAP ALUM HYB 470UF 20% 25V SMD; Manufacturer: KEMET; ESR: 25mOhm; Lifetime Temp: 2000 Hrs @ 135°C; Part Number: A781MN477M1ELAS025; Value: 470µF; Tolerance: ±20%; Voltage: 25V; Supplier 1: DigiKey; Supplier Part Number 1: 399-A781MN477M1ELAS025CT-ND
C66 C67 = GEN-CC330NT10V16KX7R603: GENERIC 0603 MLC CAPACITOR; Tolerance: ±10%; Voltage: 16V; Dielectric: X7R; Part Number: GEN-CC330NT10V16KX7R603; Value: 330nF
C68 = GEN-CC22PT10V16KX7R603: GENERIC 0603 MLC CAPACITOR; Tolerance: ±10%; Voltage: 16V; Dielectric: X7R; Part Number: GEN-CC22PT10V16KX7R603; Value: 22pF
C69 = GEN-CC1NT10V16KX7R603: GENERIC 0603 MLC CAPACITOR; Tolerance: ±10%; Voltage: 16V; Dielectric: X7R; Part Number: GEN-CC1NT10V16KX7R603; Value: 1nF
D3 = SBR10U45SP5-13: DIODE SBR 45V 10A POWERDI5; Manufacturer: Diodes Incorporated; Current - Reverse Leakage @ Vr: 300 µA @ 45 V; Diode Type: Super Barrier; Speed: Fast Recovery =< 500ns, > 200mA (Io); Voltage - Forward (Vf) (Max) @ If: 470 mV @ 10 A; Part Number: SBR10U45SP5-13; ComponentLink1Description: Datasheet; ComponentLink1URL: https://www.diodes.com/assets/Datasheets/SBR10U45SP5.pdf; ComponentLink2Description: DigiKey Link; ComponentLink2URL: https://www.digikey.com/en/products/detail/diodes-incorporated/SBR10U45SP5-13/1935355; Current - Average Rectified (Io): 10A; LastUpdated: 4/5/2026 9:26:20 PM; Lifecycle Status: Active; Minimum Order: 1; Mounting Type: Surface Mount; Operating Temperature - Junction: -65°C ~ 150°C; Package / Case: PowerDI™ 5; Packaging: TapeAndReel; PartId: 3714; Part Status: Active; Price: 0.27; Series: SBR®; Supplier 1: DigiKey; Supplier Part Number 1: SBR10U45SP5-13DICT-ND; Supplier Device Package: PowerDI™ 5; Voltage - DC Reverse (Vr) (Max): 45 V
D4 = SMDJ13A: TVS DIODE 13VWM 21.5VC DO214AB; Manufacturer: Littelfuse Inc.; Current - Peak Pulse (10/1000µs): 139.5A; Power Line Protection: No; Power - Peak Pulse: 3000W (3kW); Type: Zener; Unidirectional Channels: 1; Voltage - Breakdown (Min): 14.4V; Voltage - Clamping (Max) @ Ipp: 21.5V; Voltage - Reverse Standoff (Typ): 13V; Part Number: SMDJ13A; Applications: General Purpose; ComponentLink1Description: Datasheet; ComponentLink1URL: https://www.littelfuse.com/~/media/electronics/datasheets/tvs_diodes/littelfuse_tvs_diode_smdj_datasheet.pdf.pdf; ComponentLink2Description: DigiKey Link; ComponentLink2URL: https://www.digikey.com/en/products/detail/littelfuse-inc/SMDJ13A/2024476; LastUpdated: 4/5/2026 8:33:53 PM; Lifecycle Status: Active; Minimum Order: 1; Mounting Type: Surface Mount; Operating Temperature: -65°C ~ 150°C (TJ); Package / Case: DO-214AB, SMC; Packaging: TapeAndReel; PartId: 6478; Part Status: Active; Price: 0.33; Series: SMDJ; Supplier 1: DigiKey; Supplier Part Number 1: SMDJ13ACT-ND; Supplier Device Package: DO-214AB (SMCJ)
J1 = 1-1473776-7: CONN RCPT 10POS 2.50MM PCB SLDR; Manufacturer: TE Connectivity AMP Connectors; Part Number: 1-1473776-7; Supplier 1: DigiKey; Supplier Part Number 1: A120254-ND
NT6 NT7 = GEN-PCBVINT0S3: VIA STYLE CIRCULAR NET TIE; Part Number: GEN-PCBVINT0S3; Size Variant: 0.3mm
R23 = TLR3A20DR001FTDG: RES 0.001 OHM 1% 2W 2512; manufacturer: TE Connectivity Passive Product; Temperature Coefficient: ±50ppm/°C; Part Number: TLR3A20DR001FTDG; componentlink1description: Datasheet; componentlink1url: https://www.te.com/commerce/DocumentDelivery/DDEController?Action=srchrtrv&DocNm=1773449-3&DocType=DS&DocLang=English; componentlink2description: DigiKey Link; componentlink2url: http://digikey.com/product-detail/en/te-connectivity-passive-product/TLR3A20DR001FTDG/A129565CT-ND/8566769; Composition: Metal Foil; Device Package: 2512 (6432 Metric); Features: Current Sense; Height - Seated (Max): 0.024" (0.60mm); lastupdated: 9/2/2020 1:27:06 AM; Lifecycle Status: Active; Minimum Order: 1; Number of Terminations: 2; Operating Temperature: -55°C ~ 170°C; Package / Case: 2512 (6432 Metric); packaging: TapeAndReel; Part Status: Active; Power (Watts): 2W; price: 0.30; Resistance: 1 mOhms; series: TLR, CGS; Size / Dimension: 0.252" L x 0.126" W (6.40mm x 3.20mm); Supplier 1: DigiKey; Supplier Part Number 1: A129565CT-ND; Supplier Device Package: 2512; Tolerance: ±1%; value: 1 mOhms
R24 = GEN-CRR10T1P8603: GENERIC 0603 CHIP RESISTOR; Tolerance: ±1%; Power: 0.125W; Part Number: GEN-CRR10T1P8603; Value: 10R
R25 = GEN-CRR10KT1P8603: as R18 on sheet Voltage_Reg_12V; Part Number: GEN-CRR10KT1P8603; Value: 10k
R26 = GEN-CRR1K3T1P8603: GENERIC 0603 CHIP RESISTOR; Tolerance: ±1%; Power: 0.125W; Part Number: GEN-CRR1K3T1P8603; Value: 1.3k
R27 = GEN-CRR3K6T1P8603: GENERIC 0603 CHIP RESISTOR; Tolerance: ±1%; Power: 0.125W; Part Number: GEN-CRR3K6T1P8603; Value: 3.6k
U3 = TPS25990ARQPR: ELECTRONIC FUSE; Manufacturer: Texas Instruments; Part Number: TPS25990ARQPR; Supplier 1: DigiKey; Supplier Part Number 1: 296-TPS25990ARQPRCT-ND

## Sheet Output_Connectors.SchDoc: =SheetTitle
size B; SheetTitle: Power Output Connectors; DrawnBy: Samyar Sadat Akhavi; DocumentNumber: 16; SheetNumber: 16; SheetTotal: 19
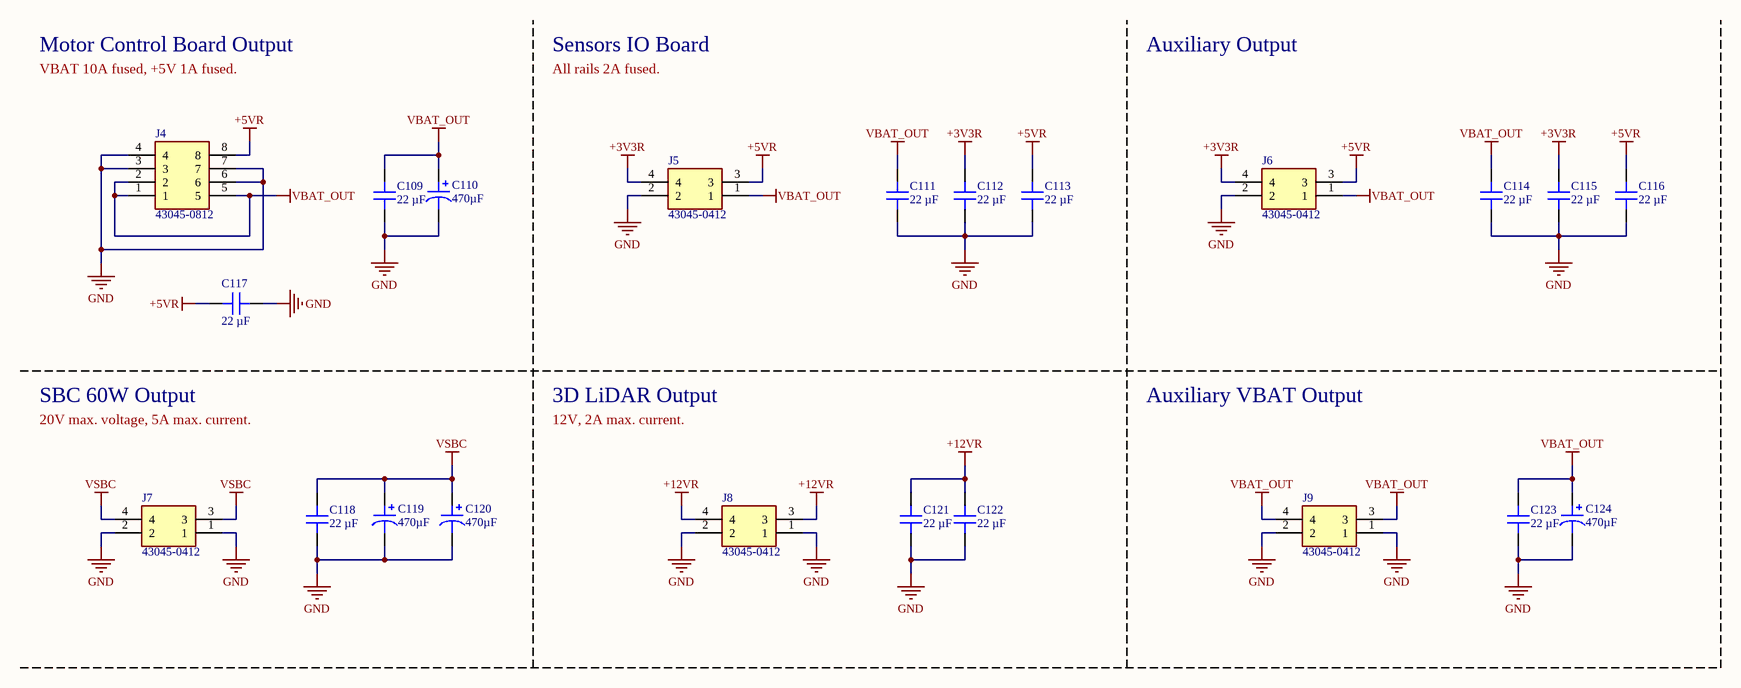
[diagram p10: Output_Connectors.SchDoc]

### Parts
(Parts that share a designator on the sheet are numbered #1, #2 ... from top to bottom, then left to right.)
?#9  (no value)  (graphical)
C109  22 µF  [CAP 1206_3216 - 0.8MM]
C110  470µF  [CAP_A781-MN_KEM]
C111  22 µF  [CAP 1206_3216 - 0.8MM]
C112  22 µF  [CAP 1206_3216 - 0.8MM]
C113  22 µF  [CAP 1206_3216 - 0.8MM]
C114  22 µF  [CAP 1206_3216 - 0.8MM]
C115  22 µF  [CAP 1206_3216 - 0.8MM]
C116  22 µF  [CAP 1206_3216 - 0.8MM]
C117  22 µF  [CAP 1206_3216 - 0.8MM]
C118  22 µF  [CAP 1206_3216 - 0.8MM]
C119  470µF  [CAP_A781-MN_KEM]
C120  470µF  [CAP_A781-MN_KEM]
C121  22 µF  [CAP 1206_3216 - 0.8MM]
C122  22 µF  [CAP 1206_3216 - 0.8MM]
C123  22 µF  [CAP 1206_3216 - 0.8MM]
C124  470µF  [CAP_A781-MN_KEM]
J4  43045-0812  [43045-08YY_121314]
J5  43045-0412  [43045-04YY_121314]
J6  43045-0412  [43045-04YY_121314]
J7  43045-0412  [43045-04YY_121314]
J8  43045-0412  [43045-04YY_121314]
J9  43045-0412  [43045-04YY_121314]

### Nets
+3V3R: C112.2 C115.2 J5.4 J6.4
+5VR: C113.2 C116.2 C117.2 J4.8 J5.3 J6.3
+12VR: C121.2 C122.2 J8.3 J8.4
GND: C109.1 C110.2 C111.1 C112.1 C113.1 C114.1 C115.1 C116.1 C117.1 C118.1 C119.2 C120.2 C121.1 C122.1 C123.1 C124.2 J4.3 J4.4 J4.6 J4.7 J5.2 J6.2 J7.1 J7.2 J8.1 J8.2 J9.1 J9.2
VBAT_OUT: C109.2 C110.1 C111.2 C114.2 C123.2 C124.1 J4.1 J4.2 J4.5 J5.1 J6.1 J9.3 J9.4
VSBC: C118.2 C119.1 C120.1 J7.3 J7.4

### Notes on the sheet
- Motor Control Board Output
- VBAT 10A fused, +5V 1A fused.
- Sensors IO Board
- All rails 2A fused.
- Auxiliary Output
- SBC 60W Output
- 20V max. voltage, 5A max. current.
- 3D LiDAR Output
- 12V, 2A max. current.
- Auxiliary VBAT Output
- Sub-Project:
- Size:
- Drawn By:
- Revision:
- Date:
- File:
- Sheet:
- of

### Library data of the parts
?#9 = SGR-STDTBSB: STANDARD SCHEMATICS TITLE BLOCK
C109 C111-C118 C121-C123 = CL31A226KAHNNNE: CAP CER 22UF 25V X5R 1206; manufacturer: Samsung Electro-Mechanics; Tolerance: ±10%; Part Number: CL31A226KAHNNNE; Capacitance: 22 µF; Applications: General Purpose; componentlink1description: Datasheet; componentlink1url: http://www.samsungsem.com/kr/support/product-search/mlcc/CL31A226KAHNNNE.jsp; componentlink2description: DigiKey Link; componentlink2url: https://www.digikey.com/en/products/detail/samsung-electro-mechanics/CL31A226KAHNNNE/3888705; Device Package: 1206 (3216 Metric); lastupdated: 4/6/2026 7:37:25 PM; Lifecycle Status: Active; Minimum Order: 1; Mounting Type: Surface Mount, MLCC; Operating Temperature: -55°C ~ 85°C; Package / Case: 1206 (3216 Metric); packaging: TapeAndReel; partid: 22185; Part Status: Active; price: 0.06; series: CL; Size / Dimension: 0.126" L x 0.063" W (3.20mm x 1.60mm); Supplier 1: DigiKey; Supplier Part Number 1: 1276-3047-1-ND; Temperature Coefficient: X5R; Thickness (Max): 0.071" (1.80mm); value: 22 µF; Voltage - Rated: 25V
C110 C119 C120 C124 = A781MN477M1ELAS025: CAP ALUM HYB 470UF 20% 25V SMD; Manufacturer: KEMET; ESR: 25mOhm; Lifetime Temp: 2000 Hrs @ 135°C; Part Number: A781MN477M1ELAS025; Value: 470µF; Tolerance: ±20%; Voltage: 25V; Supplier 1: DigiKey; Supplier Part Number 1: 399-A781MN477M1ELAS025CT-ND
J4 = 43045-0812: CONN HEADER VERT 8POS 3MM; Manufacturer: Molex; Part Number: 43045-0812; Supplier 1: DigiKey; Supplier Part Number 1: WM1792-ND
J5-J9 = 43045-0412: CONN HEADER VERT 4POS 3MM; Manufacturer: Molex; Part Number: 43045-0412; Supplier 1: DigiKey; Supplier Part Number 1: WM1790-ND

## Sheet Charger_Input.SchDoc: =SheetTitle
size A4; SheetTitle: Charger Input; DrawnBy: Samyar Sadat Akhavi; DocumentNumber: 3; SheetNumber: 3; SheetTotal: 19
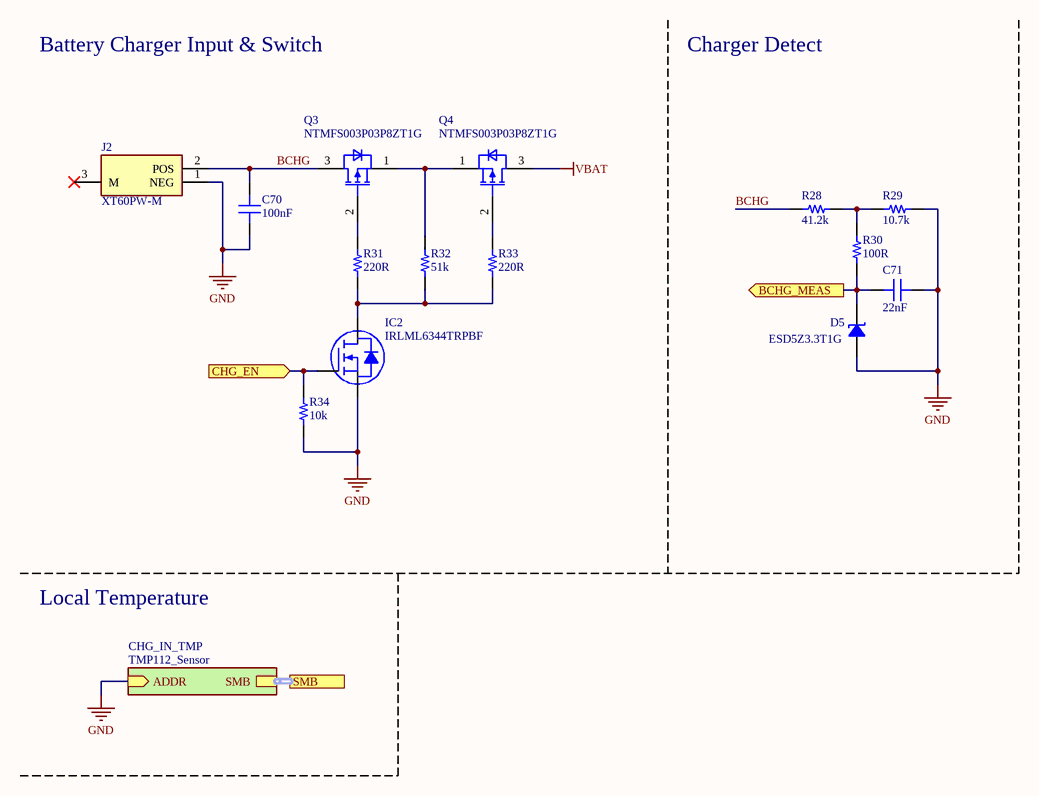
[diagram p11: Charger_Input.SchDoc]

### Parts
(Parts that share a designator on the sheet are numbered #1, #2 ... from top to bottom, then left to right.)
?#10  (no value)  (graphical)
C70  100nF  [CAP 0603_1608]
C71  22nF  [CAP 0603_1608]
D5  ESD5Z3.3T1G  [SOD523F]
IC2  IRLML6344TRPBF  [INFINEON SOT-23-3]
J2  XT60PW-M  [XT60PWM]
Q3  NTMFS003P03P8ZT1G  [NVMFS4C05NWFET1G]
Q4  NTMFS003P03P8ZT1G  [NVMFS4C05NWFET1G]
R28  41.2k  [RES 0603_1608]
R29  10.7k  [RES 0603_1608]
R30  100R  [RES 0603_1608]
R31  220R  [RES 0603_1608]
R32  51k  [RES 0603_1608]
R33  220R  [RES 0603_1608]
R34  10k  [RES 0603_1608]

### Sub-sheets
CHG_IN_TMP = TMP112_Sensor (file not in this document): ADDR (in), SMB (harness SMBus)

### Ports
BCHG_MEAS (out, see Power_Board[2B], Microcontroller[3C]), CHG_EN (in, see Power_Board[2B], Microcontroller[3A]), SMB (harness SMBus, see Power_Board[1B], Battery_Input[4A], INA236_Sensor[3B], TMP112_Sensor[3B], VBAT_Output[3B])

### Nets
GND: C70.2 C71.2 D5.1 IC2.2(S) J2.1(NEG) R29.2 R34.1 ; sheet CHG_IN_TMP/ADDR
VBAT: Q4.3(D)
BCHG: C70.1 J2.2(POS) Q3.3(D) R28.1
BCHG_MEAS: C71.1 D5.2 R30.2 ; port BCHG_MEAS
CHG_EN: IC2.1(G) R34.2 ; port CHG_EN
NetIC2_3: IC2.3(D) R31.1 R32.1 R33.1
NetQ3_1: Q3.1(S) Q4.1(S) R32.2
NetQ3_2: Q3.2(G) R31.2
NetQ4_2: Q4.2(G) R33.2
NetR28_2: R28.2 R29.1 R30.1

Not connected (* = marked no-connect by the designer): J2 3(M)*

### Buses and harness runs
harness port SMB = sheet CHG_IN_TMP/SMB

### Notes on the sheet
- Battery Charger Input & Switch
- Charger Detect
- Local Temperature
- Sub-Project:
- Size:
- Drawn By:
- Revision:
- Date:
- File:
- Sheet:
- of

### Library data of the parts
?#10 = SGR-STDTBSA4: STANDARD SCHEMATICS TITLE BLOCK
C70 = GEN-CC100NT10V50KX7R603: GENERIC 0603 MLC CAPACITOR; Tolerance: ±10%; Voltage: 50V; Dielectric: X7R; Part Number: GEN-CC100NT10V50KX7R603; Value: 100nF
C71 = GEN-CC22NT20V25KX7R603: GENERIC 0603 MLC CAPACITOR; Tolerance: ±20%; Voltage: 25V; Dielectric: X7R; Part Number: GEN-CC22NT20V25KX7R603; Value: 22nF
D5 = ESD5Z3.3T1G: TVS DIODE 3.3V 14.1V SOD523; Manufacturer: ON Semiconductor; Capacitance @ Frequency: 105pF @ 1MHz; Current - Peak Pulse (10/1000µs): 11.2A (8/20µs); Power Line Protection: No; Power - Peak Pulse: 158W; Type: Zener; Unidirectional Channels: 1; Voltage - Breakdown (Min): 5V; Voltage - Reverse Standoff (Typ): 3.3V (Max); Part Number: ESD5Z3.3T1G; Applications: General Purpose; ComponentLink1Description: Datasheet; ComponentLink1URL: https://www.onsemi.com/pub/Collateral/ESD5Z2.5T1-D.PDF; ComponentLink2Description: DigiKey Link; ComponentLink2URL: http://digikey.com/product-detail/en/on-semiconductor/ESD5Z3.3T1G/ESD5Z3.3T1GOSCT-ND/1967044; LastUpdated: 4/5/2026 9:01:13 PM; Lifecycle Status: Active; Minimum Order: 1; Mounting Type: Surface Mount; Operating Temperature: -55°C ~ 150°C (TJ); Package / Case: SC-79, SOD-523; Packaging: TapeAndReel; PartId: 9754; Part Status: Active; Price: 0.04; Series: -; Supplier 1: DigiKey; Supplier Part Number 1: ESD5Z3.3T1GOSCT-ND; Supplier Device Package: SOD-523; Voltage - Clamping (Max) @ Ipp: 14.1V
IC2 = IRLML6344TRPBF: MOSFET N-CH 30V 5A MICRO3/SOT23; Manufacturer: Infineon Technologies; Current - Continuous Drain (Id) @ 25°C: 5A (Ta); Drive Voltage (Max Rds On,  Min Rds On): 2.5V, 4.5V; FET Type: N-Channel; Gate Charge (Qg) (Max) @ Vgs: 6.8 nC @ 4.5 V; Input Capacitance (Ciss) (Max) @ Vds: 650 pF @ 25 V; Power Dissipation (Max): 1.3W (Ta); Rds On (Max) @ Id, Vgs: 29mOhm @ 5A, 4.5V; Vgs (Max): ±12V; Vgs(th) (Max) @ Id: 1.1V @ 10µA; Part Number: IRLML6344TRPBF; ComponentLink1Description: Datasheet; ComponentLink1URL: https://www.infineon.com/dgdl/irlml6344pbf.pdf?fileId=5546d462533600a4015356689c44262c; ComponentLink2Description: DigiKey Link; ComponentLink2URL: https://www.digikey.com/en/products/detail/infineon-technologies/IRLML6344TRPBF/2538152; Drain to Source Voltage (Vdss): 30 V; LastUpdated: 4/5/2026 8:53:29 PM; Lifecycle Status: Active; Minimum Order: 1; Mounting Type: Surface Mount; Operating Temperature: -55°C ~ 150°C (TJ); Package / Case: TO-236-3, SC-59, SOT-23-3; Packaging: TapeAndReel; Part Status: Active; Price: 0.09; Series: HEXFET®; Supplier 1: DigiKey; Supplier Part Number 1: IRLML6344TRPBFCT-ND; Supplier Device Package: Micro3™/SOT-23; Technology: MOSFET (Metal Oxide)
J2 = XT60PW-M: MALE XT60 PCB-MOUNT SOLDERABLE CONNECTOR; Manufacturer: AMASS; Part Number: XT60PW-M; Supplier 1: TME; Supplier Part Number 1: XT60PW-M
Q3 Q4 = NTMFS003P03P8ZT1G: MOSFET, POWER -30V P-CHANNEL, SO; Manufacturer: onsemi; Part Number: NTMFS003P03P8ZT1G; Supplier 1: DigiKey; Supplier Part Number 1: 488-NTMFS003P03P8ZT1G-ND
R28 = GEN-CRR41K2T1P8603: GENERIC 0603 CHIP RESISTOR; Tolerance: ±1%; Power: 0.125W; Part Number: GEN-CRR41K2T1P8603; Value: 41.2k
R29 = GEN-CRR10K7T1P8603: GENERIC 0603 CHIP RESISTOR; Tolerance: ±1%; Power: 0.125W; Part Number: GEN-CRR10K7T1P8603; Value: 10.7k
R30 = GEN-CRR100T1P8603: GENERIC 0603 CHIP RESISTOR; Tolerance: ±1%; Power: 0.125W; Part Number: GEN-CRR100T1P8603; Value: 100R
R31 R33 = GEN-CRR220T5P8603: GENERIC 0603 CHIP RESISTOR; Tolerance: ±5%; Power: 0.125W; Part Number: GEN-CRR220T5P8603; Value: 220R
R32 = GEN-CRR51KT5P8603: GENERIC 0603 CHIP RESISTOR; Tolerance: ±5%; Power: 0.125W; Part Number: GEN-CRR51KT5P8603; Value: 51k
R34 = GEN-CRR10KT1P8603: GENERIC 0603 CHIP RESISTOR; Tolerance: ±1%; Power: 0.125W; Part Number: GEN-CRR10KT1P8603; Value: 10k

## Sheet User_Control_IO.SchDoc: =SheetTitle
size A4; SheetTitle: User Control Buttons IO; DrawnBy: Samyar Sadat Akhavi; DocumentNumber: 7; SheetNumber: 7; SheetTotal: 19
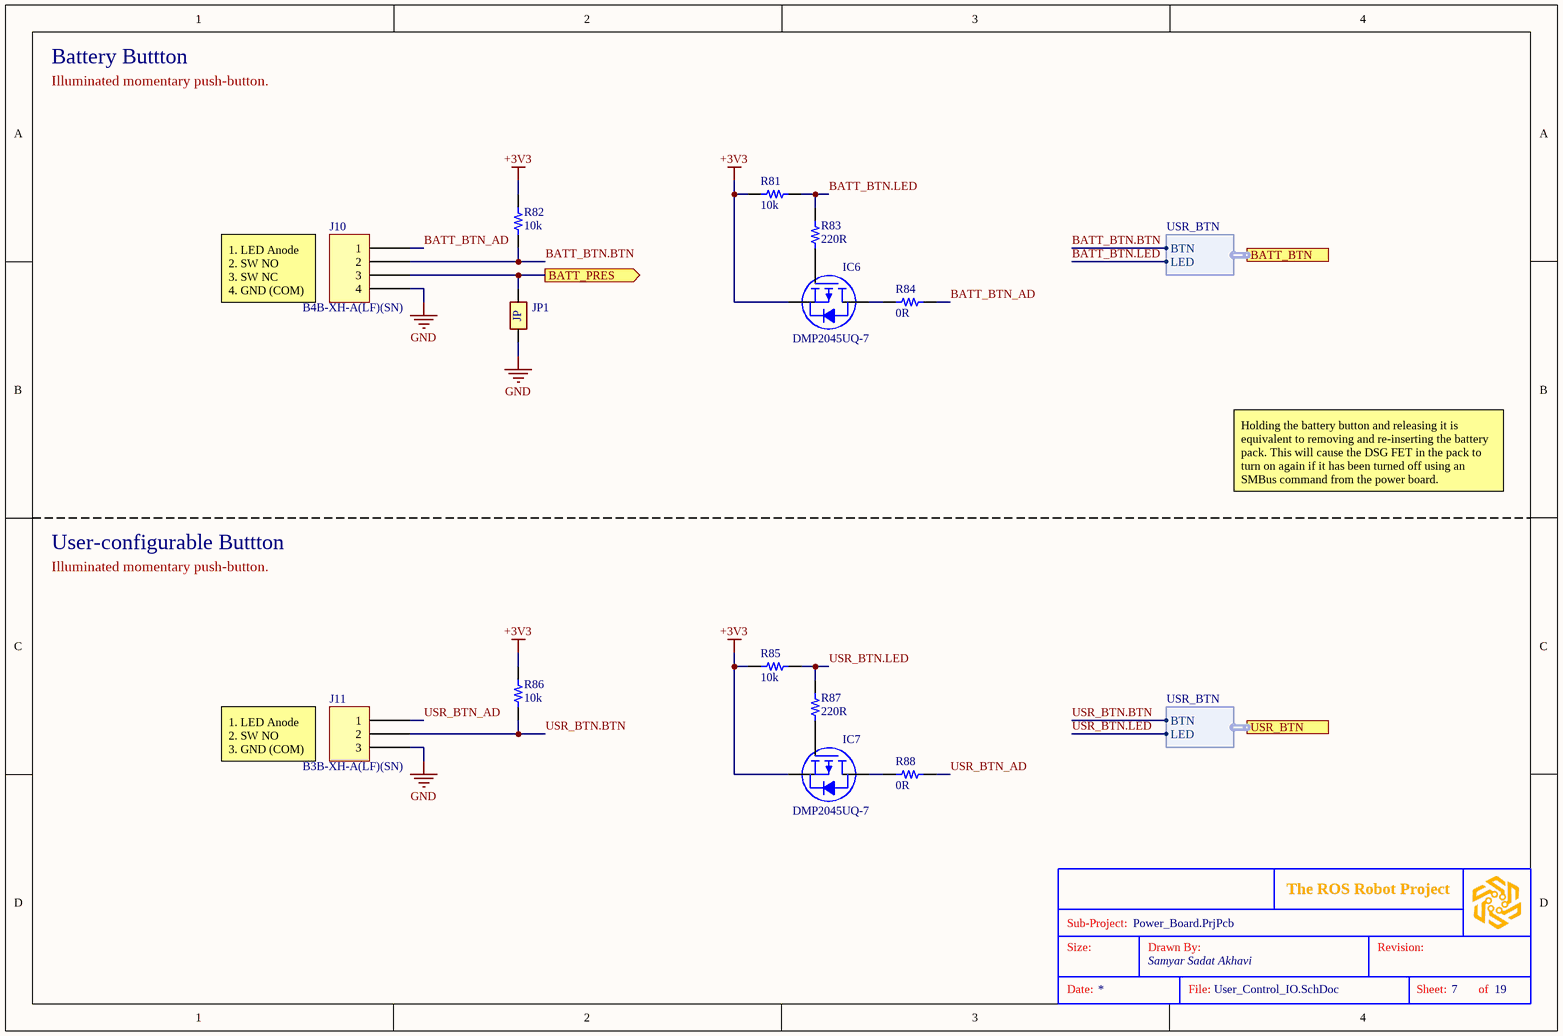
[diagram p12: User_Control_IO.SchDoc]

### Parts
(Parts that share a designator on the sheet are numbered #1, #2 ... from top to bottom, then left to right.)
?#11  (no value)  (graphical)
IC6  DMP2045UQ-7  [DIODES SOT-23-3]
IC7  DMP2045UQ-7  [DIODES SOT-23-3]
J10  B4B-XH-A(LF)(SN)  [JST XH B4B-XH-A]
J11  B3B-XH-A(LF)(SN)  [JST XH B3B-XH-A]
JP1  Jumper Pad  [Jumper_Pad]  (value not drawn)  (no BOM)
R81  10k  [RES 0603_1608]
R82  10k  [RES 0603_1608]
R83  220R  [RES 0603_1608]
R84  0R  [RES 0603_1608]
R85  10k  [RES 0603_1608]
R86  10k  [RES 0603_1608]
R87  220R  [RES 0603_1608]
R88  0R  [RES 0603_1608]

### Ports
BATT_BTN (harness USR_BTN, see Power_Board[2B], Microcontroller[4A]), BATT_PRES (out, see Power_Board[1B], Battery_Input[3A]), USR_BTN (harness USR_BTN, see Power_Board[2B], Microcontroller[4A])

### Harnesses
USR_BTN: LED, BTN
USR_BTN: BTN, LED

### Nets
+3V3: IC6.2(S) IC7.2(S) R81.1 R82.2 R85.1 R86.2
GND: J10.4 J11.3 JP1.1
BATT_BTN.BTN: J10.2 R82.1 ; port BATT_BTN.BTN
BATT_BTN.LED: R81.2 R83.2 ; port BATT_BTN.LED
BATT_BTN_AD: J10.1 R84.2
BATT_PRES: J10.3 JP1.2 ; port BATT_PRES
USR_BTN.BTN: J11.2 R86.1 ; port USR_BTN.BTN
USR_BTN.LED: R85.2 R87.2 ; port USR_BTN.LED
USR_BTN_AD: J11.1 R88.2
NetIC6_1: IC6.1(G) R83.1
NetIC6_3: IC6.3(D) R84.1
NetIC7_1: IC7.1(G) R87.1
NetIC7_3: IC7.3(D) R88.1

### Notes on the sheet
- Battery Buttton
- Illuminated momentary push-button.
- 1. LED Anode
  2. SW NO
  3. SW NC
  4. GND (COM)
- Holding the battery button and releasing it is equivalent to removing and re-inserting the battery pack. This will cause the DSG FET in the pack to turn on again if it has been turned off using an SMBus command from the power board.
- User-configurable Buttton
- 1. LED Anode
  2. SW NO
  3. GND (COM)
- Sub-Project:
- Size:
- Drawn By:
- Revision:
- Date:
- File:
- Sheet:
- of
- (in symbol GEN-PCBSJPS2) JP

### Library data of the parts
?#11 = SGR-STDTBSA4: STANDARD SCHEMATICS TITLE BLOCK
IC6 IC7 = DMP2045UQ-7: MOSFET P-CH 20V 4.3A SOT23; Manufacturer: Diodes Incorporated; Current - Continuous Drain (Id) @ 25°C: 4.3A (Ta); Drive Voltage (Max Rds On,  Min Rds On): 1.8V, 4.5V; FET Type: P-Channel; Gate Charge (Qg) (Max) @ Vgs: 6.8 nC @ 4.5 V; Input Capacitance (Ciss) (Max) @ Vds: 634 pF @ 10 V; Power Dissipation (Max): 800mW (Ta); Rds On (Max) @ Id, Vgs: 45mOhm @ 4A, 4.5V; Vgs (Max): ±8V; Vgs(th) (Max) @ Id: 1V @ 250µA; Part Number: DMP2045UQ-7; ComponentLink1Description: Datasheet; ComponentLink1URL: https://www.diodes.com/assets/Datasheets/DMP2045UQ.pdf; ComponentLink2Description: DigiKey Link; ComponentLink2URL: https://www.digikey.com/en/products/detail/diodes-incorporated/DMP2045UQ-7/10674156; Drain to Source Voltage (Vdss): 20 V; LastUpdated: 6/3/2024 8:15:19 PM; Lifecycle Status: Active; Minimum Order: 1; Mounting Type: Surface Mount; Operating Temperature: -55°C ~ 150°C (TJ); Package / Case: TO-236-3, SC-59, SOT-23-3; Packaging: TapeAndReel; Part Status: Active; Price: 0.08; Series: -; Supplier 1: DigiKey; Supplier Part Number 1: 31-DMP2045UQ-7CT-ND; Supplier Device Package: SOT-23-3; Technology: MOSFET (Metal Oxide)
J10 = B4B-XH-A(LF)(SN): CONN HEADER VERT 4POS 2.5MM; Manufacturer: JST Sales America Inc.; Contact Length - Post: 0.134" (3.40mm); Current Rating (Amps): 3A; Material Flammability Rating: UL94 V-0; Number of Positions: 4; Number of Positions Loaded: All; Pitch - Mating: 0.098" (2.50mm); Shrouding: Shrouded - 4 Wall; Style: Board to Cable/Wire; Voltage Rating: 250V; Part Number: B4B-XH-A(LF)(SN); ComponentLink1Description: Datasheet; ComponentLink1URL: http://www.jst-mfg.com/product/pdf/eng/eXH.pdf; ComponentLink2Description: DigiKey Link; ComponentLink2URL: http://digikey.com/product-detail/en/jst-sales-america-inc/B4B-XH-A-LF-SN/455-2249-ND/1651047; Connector Type: Header; Contact Finish - Mating: Tin; Contact Finish - Post: Tin; Contact Material: Brass; Contact Shape: Square; Contact Type: Male Pin; Fastening Type: Detent Lock; Insulation Color: Natural; Insulation Height: 0.276" (7.00mm); Insulation Material: Polyamide (PA66), Nylon 6/6; LastUpdated: 1/12/2020 11:46:34 PM; Lifecycle Status: Active; Minimum Order: 1; Mounting Type: Through Hole; Number of Rows: 1; Operating Temperature: -25°C ~ 85°C; Packaging: Bulk; PartId: 69; Part Status: Active; Price: 0.21; Series: XH; Supplier 1: DigiKey; Supplier Part Number 1: 455-2249-ND; Termination: Press-Fit, Solder
J11 = B3B-XH-A(LF)(SN): CONN HEADER VERT 3POS 2.5MM; Manufacturer: JST Sales America Inc.; Contact Length - Post: 0.134" (3.40mm); Current Rating (Amps): 3A; Material Flammability Rating: UL94 V-0; Number of Positions: 3; Number of Positions Loaded: All; Pitch - Mating: 0.098" (2.50mm); Shrouding: Shrouded - 4 Wall; Style: Board to Cable/Wire; Voltage Rating: 250V; Part Number: B3B-XH-A(LF)(SN); ComponentLink1Description: Datasheet; ComponentLink1URL: http://www.jst-mfg.com/product/pdf/eng/eXH.pdf; ComponentLink2Description: DigiKey Link; ComponentLink2URL: http://digikey.com/product-detail/en/jst-sales-america-inc/B3B-XH-A-LF-SN/455-2248-ND/1651046; Connector Type: Header; Contact Finish - Mating: Tin; Contact Finish - Post: Tin; Contact Material: Brass; Contact Shape: Square; Contact Type: Male Pin; Fastening Type: Detent Lock; Insulation Color: Natural; Insulation Height: 0.276" (7.00mm); Insulation Material: Polyamide (PA66), Nylon 6/6; LastUpdated: 1/12/2020 11:46:22 PM; Lifecycle Status: Active; Minimum Order: 1; Mounting Type: Through Hole; Number of Rows: 1; Operating Temperature: -25°C ~ 85°C; Packaging: Bulk; PartId: 68; Part Status: Active; Price: 0.19; Series: XH; Supplier 1: DigiKey; Supplier Part Number 1: 455-2248-ND; Termination: Press-Fit, Solder
JP1 = GEN-PCBSJPS2: CIRCULAR, SOLDERABLE JUMPER SELECTOR PAD; Part Number: GEN-PCBSJPS2; Size Variant: 2mm
R81 R82 R85 R86 = GEN-CRR10KT1P8603: as R34 on sheet Charger_Input; Part Number: GEN-CRR10KT1P8603; Value: 10k
R83 R87 = GEN-CRR220T5P8603: as R31 on sheet Charger_Input; Part Number: GEN-CRR220T5P8603; Value: 220R
R84 R88 = GEN-CRR0603: GENERIC 0603 CHIP RESISTOR (JUMPER); Part Number: GEN-CRR0603; Value: 0R

## Sheet External_SSR.SchDoc: =SheetTitle
size A4; SheetTitle: External SSR Triggers; DrawnBy: Samyar Sadat Akhavi; DocumentNumber: 6; SheetNumber: 6; SheetTotal: 19
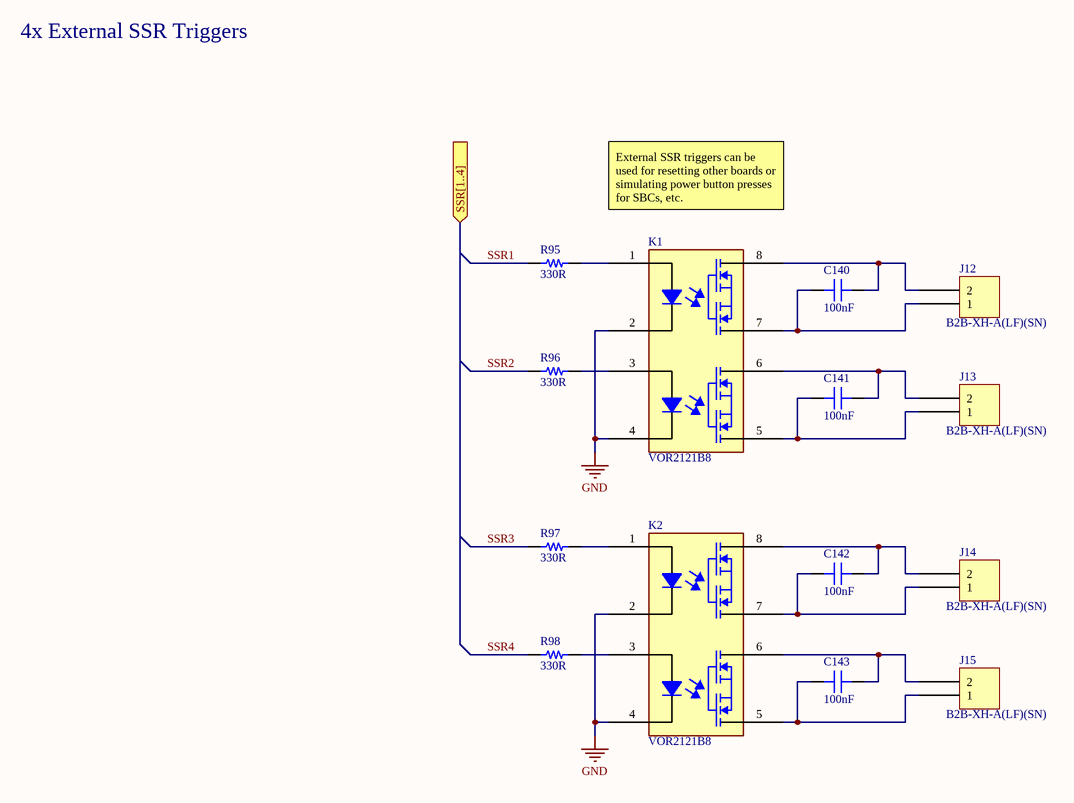
[diagram p13: External_SSR.SchDoc]

### Parts
(Parts that share a designator on the sheet are numbered #1, #2 ... from top to bottom, then left to right.)
?#12  (no value)  (graphical)
C140  100nF  [CAP 0603_1608]
C141  100nF  [CAP 0603_1608]
C142  100nF  [CAP 0603_1608]
C143  100nF  [CAP 0603_1608]
J12  B2B-XH-A(LF)(SN)  [JST XH B2B-XH-A]
J13  B2B-XH-A(LF)(SN)  [JST XH B2B-XH-A]
J14  B2B-XH-A(LF)(SN)  [JST XH B2B-XH-A]
J15  B2B-XH-A(LF)(SN)  [JST XH B2B-XH-A]
K1  VOR2121B8  [SMD-8_VOR2121B_VIS]
K2  VOR2121B8  [SMD-8_VOR2121B_VIS]
R95  330R  [RES 0603_1608]
R96  330R  [RES 0603_1608]
R97  330R  [RES 0603_1608]
R98  330R  [RES 0603_1608]

### Ports
SSR[1..4] (in, see Power_Board[3B], Microcontroller[3B])

### Nets
GND: K1.2 K1.4 K2.2 K2.4
SSR1: R95.1
SSR2: R96.1
SSR3: R97.1
SSR4: R98.1
NetC140_1: C140.1 J12.2 K1.8
NetC140_2: C140.2 J12.1 K1.7
NetC141_1: C141.1 J13.2 K1.6
NetC141_2: C141.2 J13.1 K1.5
NetC142_1: C142.1 J14.2 K2.8
NetC142_2: C142.2 J14.1 K2.7
NetC143_1: C143.1 J15.2 K2.6
NetC143_2: C143.2 J15.1 K2.5
NetK1_1: K1.1 R95.2
NetK1_3: K1.3 R96.2
NetK2_1: K2.1 R97.2
NetK2_3: K2.3 R98.2

### Notes on the sheet
- 4x External SSR Triggers
- External SSR triggers can be used for resetting other boards or simulating power button presses for SBCs, etc.
- Sub-Project:
- Size:
- Drawn By:
- Revision:
- Date:
- File:
- Sheet:
- of

### Library data of the parts
?#12 = SGR-STDTBSA4: STANDARD SCHEMATICS TITLE BLOCK
C140-C143 = GEN-CC100NT10V50KX7R603: as C70 on sheet Charger_Input; Part Number: GEN-CC100NT10V50KX7R603; Value: 100nF
J12-J15 = B2B-XH-A(LF)(SN): CONN HEADER VERT 2POS 2.5MM; Manufacturer: JST Sales America Inc.; Contact Length - Post: 0.134" (3.40mm); Current Rating (Amps): 3A; Material Flammability Rating: UL94 V-0; Number of Positions: 2; Number of Positions Loaded: All; Pitch - Mating: 0.098" (2.50mm); Shrouding: Shrouded - 4 Wall; Style: Board to Cable/Wire; Voltage Rating: 250V; Part Number: B2B-XH-A(LF)(SN); ComponentLink1Description: Datasheet; ComponentLink1URL: http://www.jst-mfg.com/product/pdf/eng/eXH.pdf; ComponentLink2Description: DigiKey Link; ComponentLink2URL: http://digikey.com/product-detail/en/jst-sales-america-inc/B2B-XH-A-LF-SN/455-2247-ND/1651045; Connector Type: Header; Contact Finish - Mating: Tin; Contact Finish - Post: Tin; Contact Material: Brass; Contact Shape: Square; Contact Type: Male Pin; Fastening Type: Detent Lock; Insulation Color: Natural; Insulation Height: 0.276" (7.00mm); Insulation Material: Polyamide (PA66), Nylon 6/6; LastUpdated: 1/12/2020 11:46:08 PM; Lifecycle Status: Active; Minimum Order: 1; Mounting Type: Through Hole; Number of Rows: 1; Operating Temperature: -25°C ~ 85°C; Packaging: Bulk; PartId: 67; Part Status: Active; Price: 0.15; Series: XH; Supplier 1: DigiKey; Supplier Part Number 1: 455-2247-ND; Termination: Press-Fit, Solder
K1 K2 = VOR2121B8: SSR RELAY SPST-NO 200MA 0-250V; Manufacturer: Vishay Semiconductor Opto Division; Copyright: Copyright (C) 2026 Ultra Librarian. All rights reserved.; Part Number: VOR2121B8; Supplier 1: DigiKey; Supplier Part Number 1: VOR2121B8-ND
R95-R98 = GEN-CRR330T5P8603: GENERIC 0603 CHIP RESISTOR; Tolerance: ±5%; Power: 0.125W; Part Number: GEN-CRR330T5P8603; Value: 330R

## Sheet VBAT_Output.SchDoc: =SheetTitle
size A4; SheetTitle: Protected VBAT Output; DrawnBy: Samyar Sadat Akhavi; DocumentNumber: 8; SheetNumber: 8; SheetTotal: 19
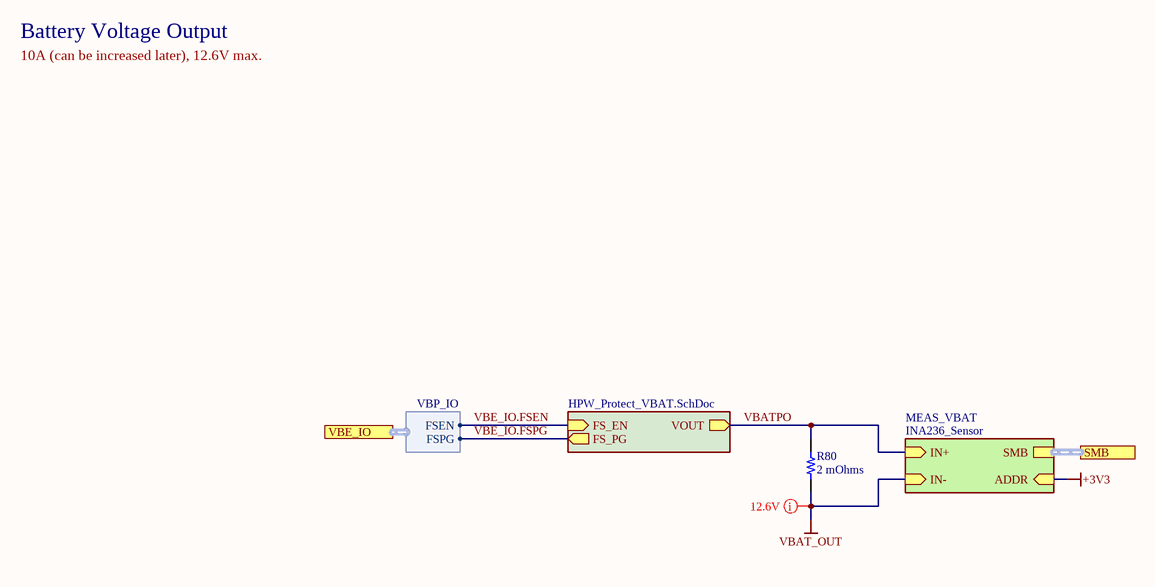
[diagram p14: VBAT_Output.SchDoc]

### Parts
(Parts that share a designator on the sheet are numbered #1, #2 ... from top to bottom, then left to right.)
?#13  (no value)  (graphical)
R80  2 mOhms  [STACKPOLE CSR2512]

### Sub-sheets
MEAS_VBAT = INA236_Sensor (file not in this document): IN- (in), ADDR (in), SMB (harness SMBus), IN+ (in)
VBAT_OUT = HPW_Protect_VBAT.SchDoc: VOUT (out), FS_EN (in), FS_PG (out)

### Ports
SMB (harness SMBus, see Power_Board[3A], Battery_Input[4A], Charger_Input[1C], INA236_Sensor[3B], TMP112_Sensor[3B]), VBE_IO (harness VBP_IO, see Power_Board[3A], Microcontroller[4A])

### Harnesses
VBP_IO: FSEN, FSPG

### Nets
VBAT_OUT: R80.1 ; sheet MEAS_VBAT/IN-
VBATPO: R80.2 ; sheet VBAT_OUT/VOUT, sheet MEAS_VBAT/IN+
VBE_IO.FSEN: sheet VBAT_OUT/FS_EN, port VBE_IO.FSEN
VBE_IO.FSPG: sheet VBAT_OUT/FS_PG, port VBE_IO.FSPG

### Buses and harness runs
harness port SMB = sheet MEAS_VBAT/SMB

### Layout directives
rule Supply Nets [Voltage = 12.60]: VBAT_OUT

### Notes on the sheet
- Battery Voltage Output
- 10A (can be increased later), 12.6V max.
- Sub-Project:
- Size:
- Drawn By:
- Revision:
- Date:
- File:
- Sheet:
- of

### Library data of the parts
?#13 = SGR-STDTBSA4: STANDARD SCHEMATICS TITLE BLOCK
R80 = TLR3A20DR002FTDG: RES 0.002 OHM 1% 2W 2512; Manufacturer: TE Connectivity Passive Product; Temperature Coefficient: ±50ppm/°C; Part Number: TLR3A20DR002FTDG; Package / Case: 2512 (6432 Metric); ComponentLink1Description: Datasheet; ComponentLink1URL: https://www.te.com/commerce/DocumentDelivery/DDEController?Action=srchrtrv&DocNm=1773449-3&DocType=DS&DocLang=English; ComponentLink2Description: DigiKey Link; ComponentLink2URL: http://digikey.com/product-detail/en/te-connectivity-passive-product/TLR3A20DR002FTDG/A129566CT-ND/8566770; Composition: Metal Foil; Device Package: 2512 (6432 Metric); Features: Current Sense; Height - Seated (Max): 0.024" (0.60mm); LastUpdated: 9/2/2020 1:18:06 AM; Lifecycle Status: Active; Minimum Order: 1; Number of Terminations: 2; Operating Temperature: -55°C ~ 170°C; Packaging: TapeAndReel; PartId: 1492; Part Status: Active; Power (Watts): 2W; Price: 0.30; Resistance: 2 mOhms; Series: TLR, CGS; Size / Dimension: 0.252" L x 0.126" W (6.40mm x 3.20mm); Supplier 1: DigiKey; Supplier Part Number 1: A129566CT-ND; Supplier Device Package: 2512; Tolerance: ±1%; Value: 2 mOhms